# EasyEDA Pro project 3轴6.1--esp32 -(1031) I2S.eprj, board PCB
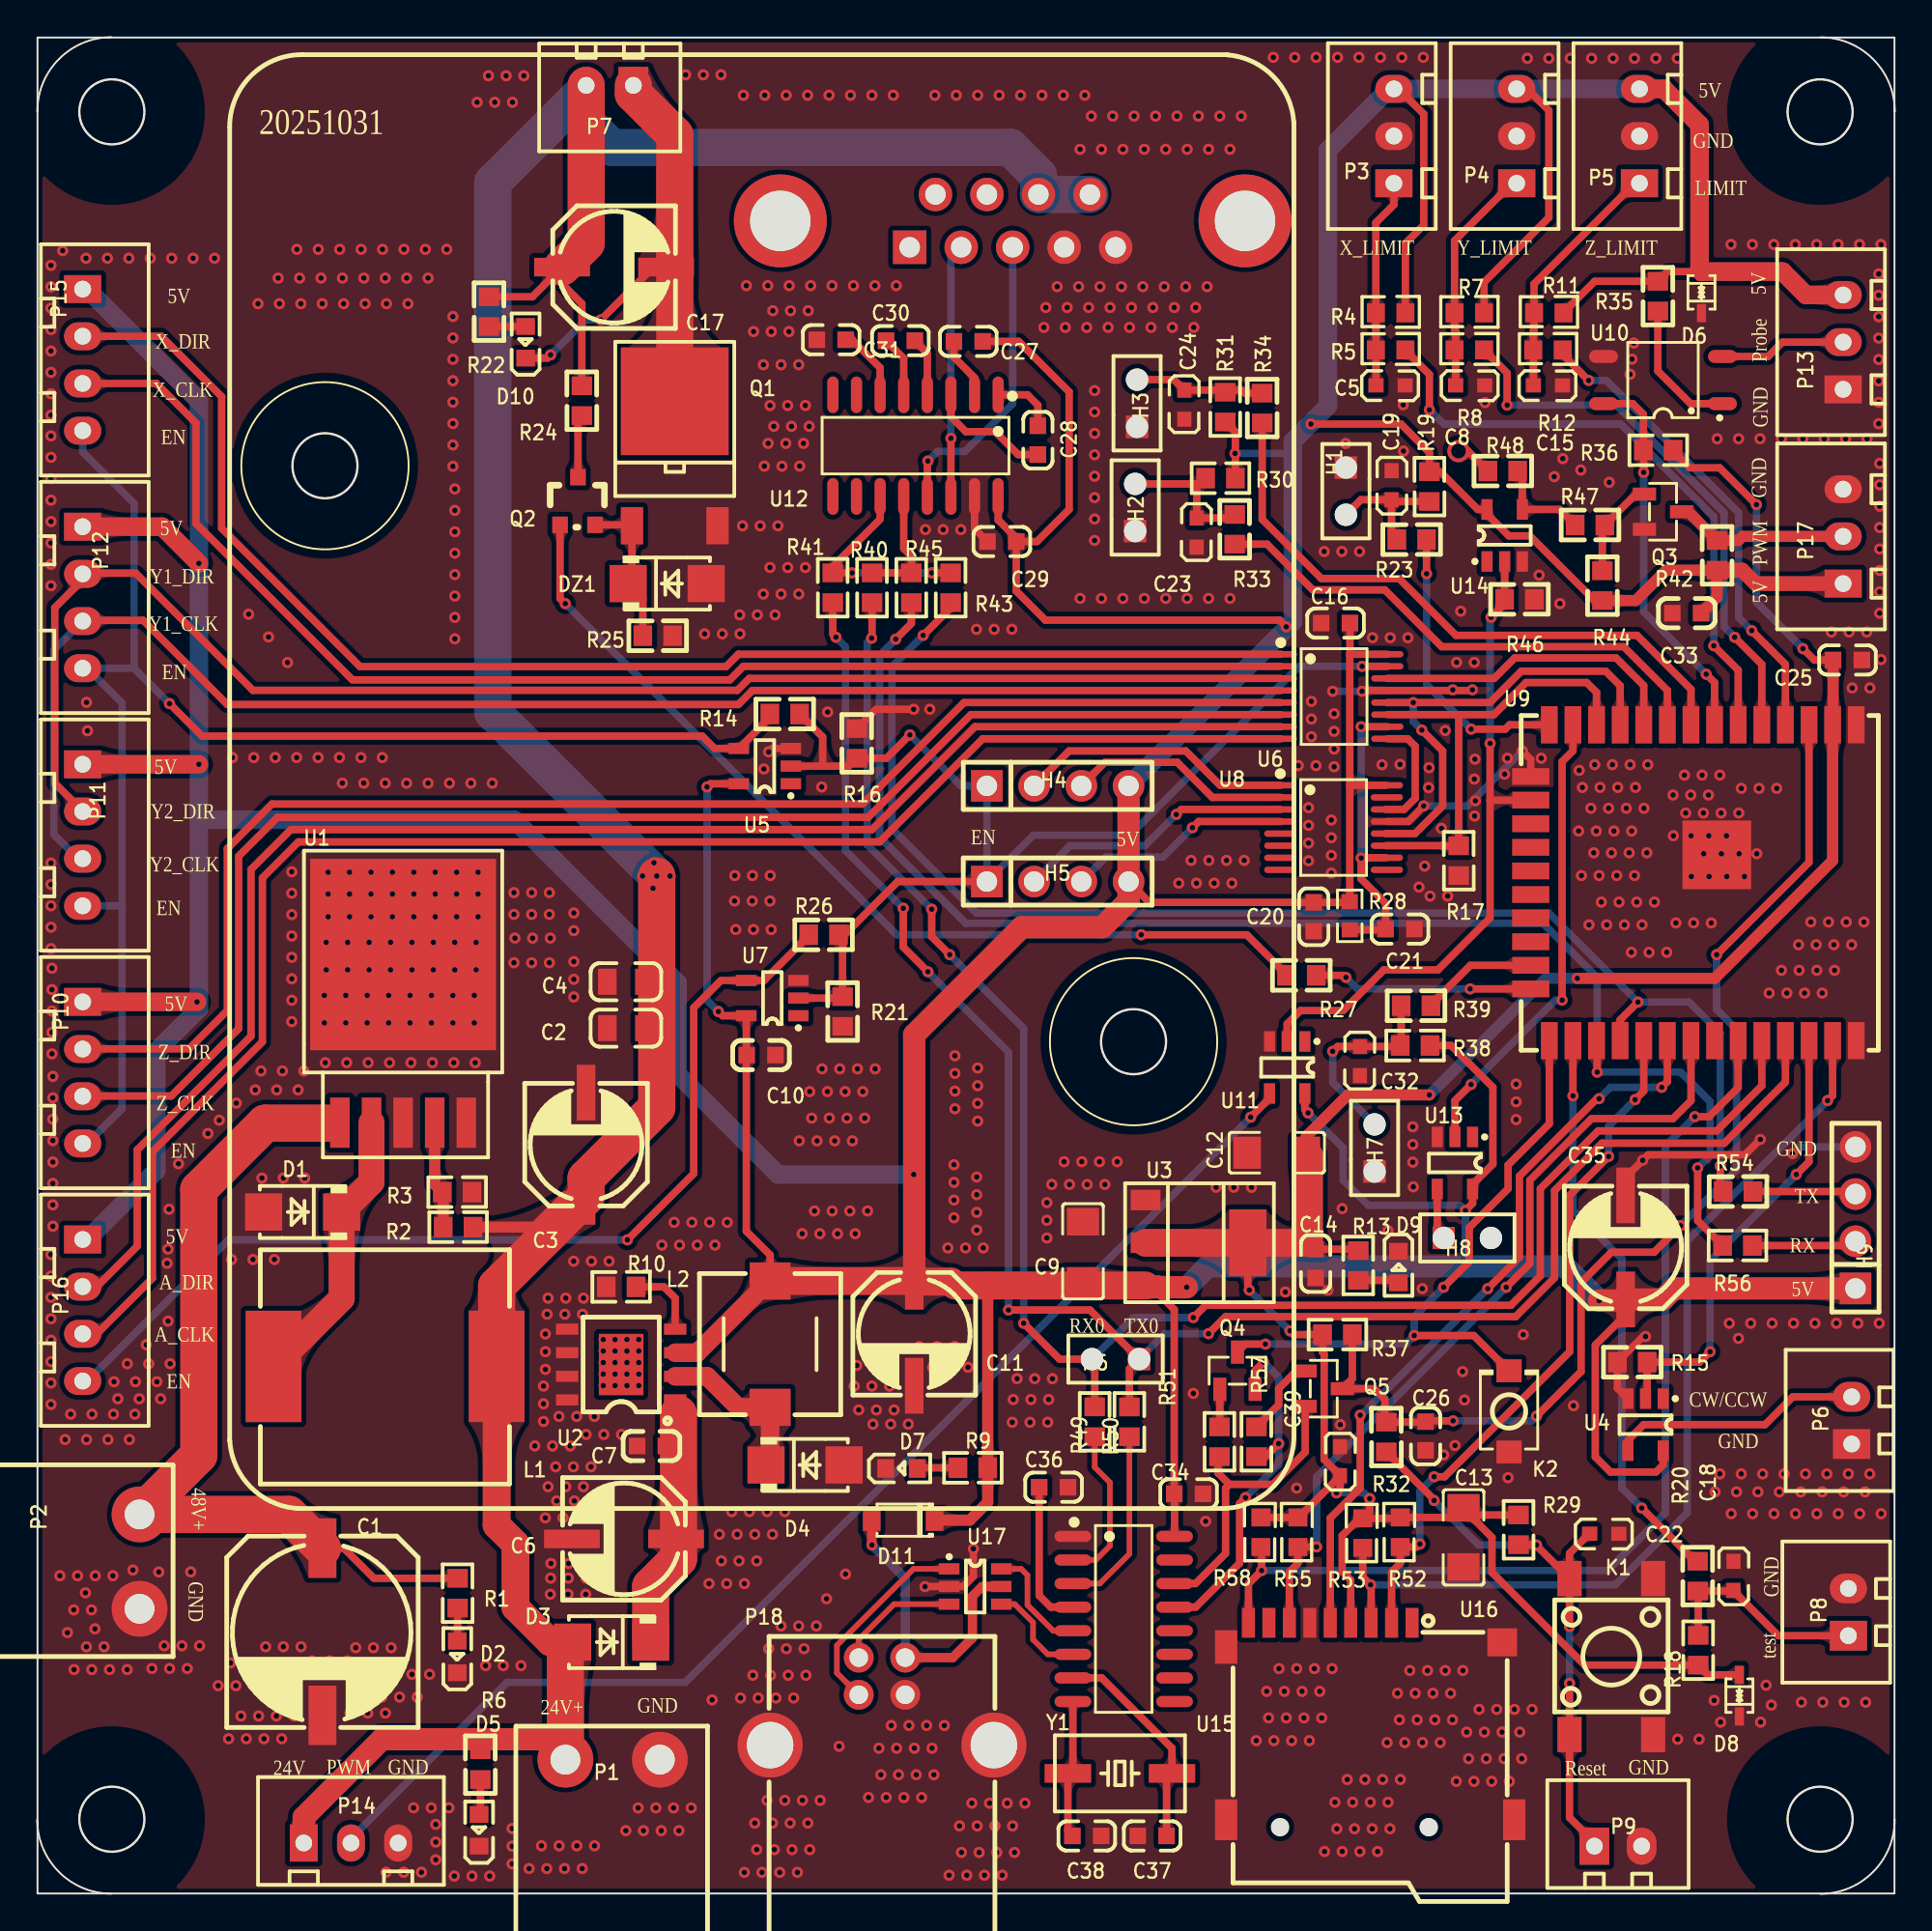
[diagram p1: board, top side]
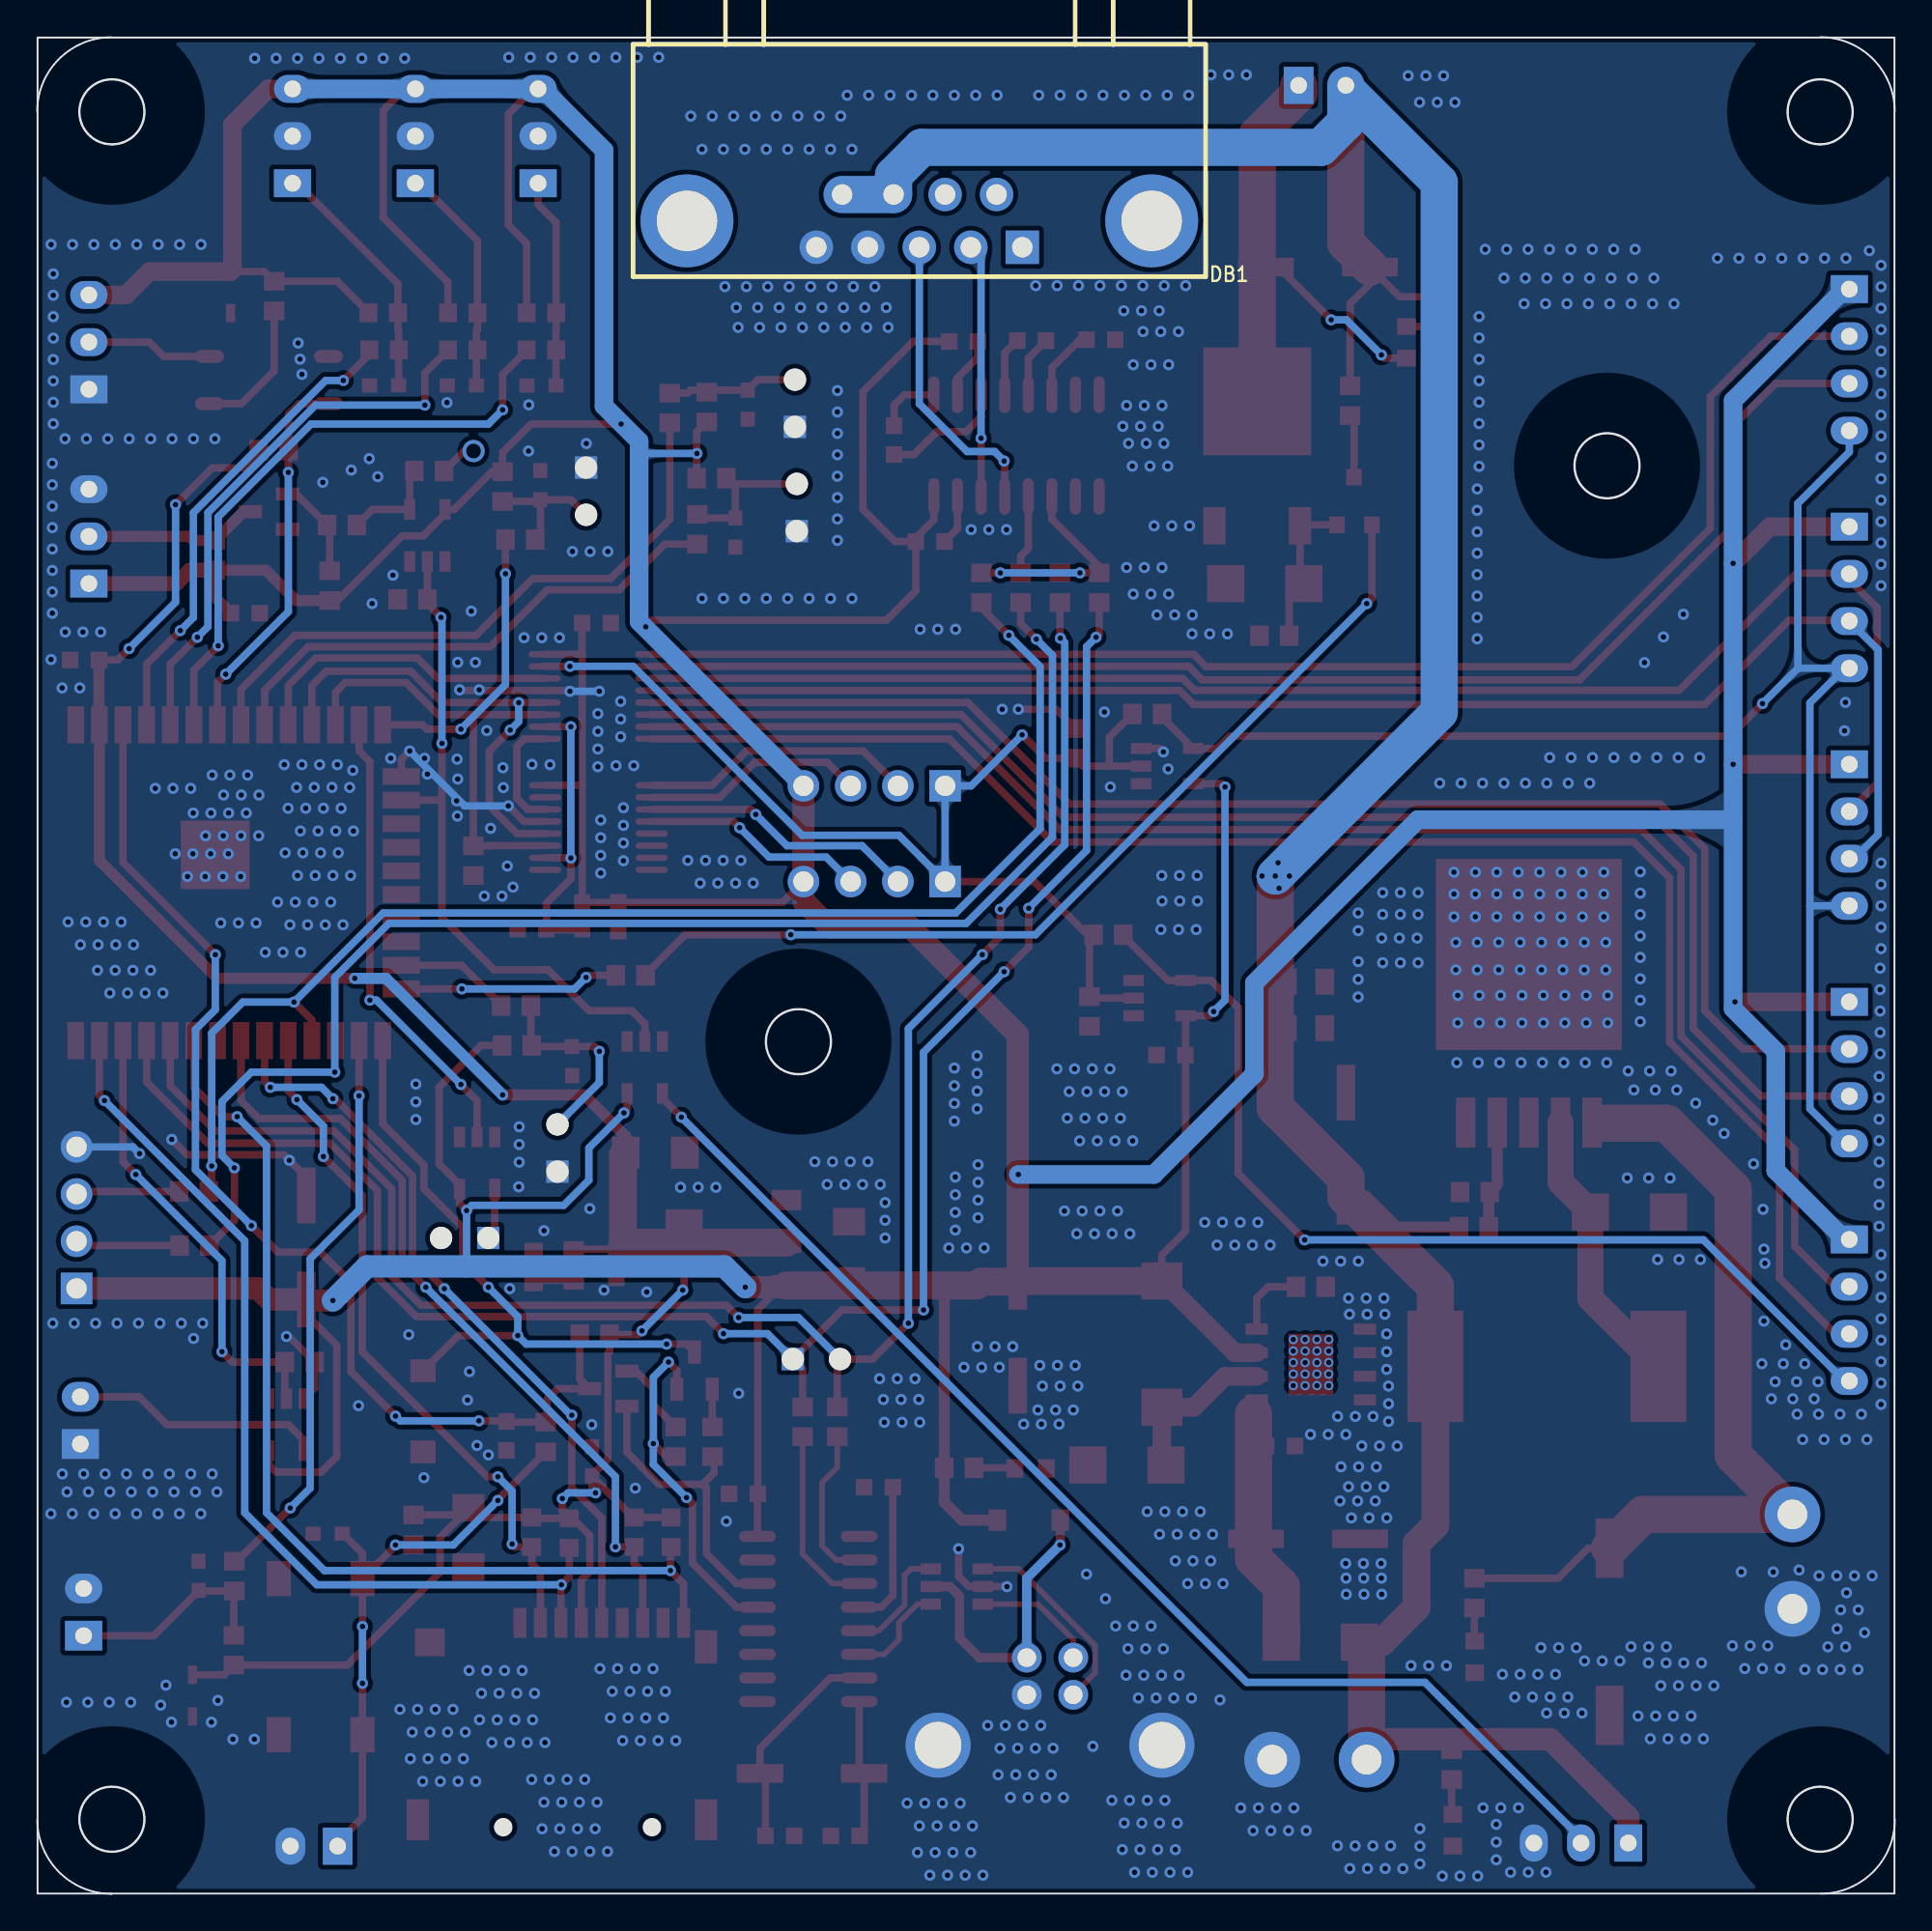
[diagram p2: board, bottom side, seen from below]

Outline 99.94 x 99.94 mm; copper layers: Top Layer, Bottom Layer. Coordinates in mm from the lower left corner of the outline.
Outline path: rectangle 0.02,99.92 99.92,0.02 ; circle c4.02,95.92 r1.75 ; circle c4.02,4.02 r1.75 ; circle c15.48,76.87 r1.75 ; circle c58.98,45.87 r1.75 ; circle c95.92,95.92 r1.75 ; circle c95.92,4.02 r1.75 ; 0.01,95.94 arc(1.18,98.77) 4.01,99.94 ; 4,0.01 arc(1.17,1.18) 0,4.01 ; 95.94,99.93 arc(98.77,98.76) 99.94,95.93 ; 99.93,4 arc(98.76,1.17) 95.93,0
Stack: Top Layer 0.035mm / Dielectric1 1.51mm FR4 er 4.5 / Bottom Layer 0.035mm

## Design rules (mm)
template: 用户自定义配置
spacing Default (default): track to track 0.152, other pairs 0 to 0.152
track width Default (default): min 0.254, default 0.254, max 25.4
differential pair differentialPair (default): width min 0.127, default 0.254, max 2.54; gap min 0.152, default 0.152
via Default (default): diameter min 0.25, default 0.61, max 100.025; hole min 0.2, default 0.305, max 59.995

## Placement (name value [footprint] x y rotation side)
C1  100uF/63V  [电解电容贴片10x10]  15.25 14.36 270 top
C2  104  [0805C]  31.67 46.6 0 top
C3  100uF/35V  [电解电容贴片6X6]  29.53 40.32 90 top
C4  105  [0805C]  31.67 49.09 180 top
C5  103  [11]  73.55 80.89 0 top
C6  100uF/35V  [电解电容贴片6X6]  31.57 19.11 180 top
C7  104  [0603C]  33.05 24.1 0 top
C8  103  [11]  77.83 80.89 0 top
C9  10uF  [C1206]  56.26 34.58 90 top
C10  104  [0603C]  38.94 45.15 180 top
C11  100uF/35V  [电解电容贴片6X6]  47.18 30.15 270 top
C12  4.7uF  [C1206]  66.69 39.89 0 top
C13  4.7uF  [C1206]  76.73 19.19 90 top
C14  104  [0603C]  68.78 33.92 90 top
C15  103  [11]  82.02 80.89 0 top
C16  104  [0603C]  69.85 68.4 180 top
C17  100uF/35V  [电解电容贴片6X6]  31.04 87.56 0 top
C18  103  [11]  91.55 17.86 90 top
C19  103  [11]  73.16 76.56 90 top
C20  104  [0603C]  68.68 52.59 270 top
C21  104  [0603C]  73.32 51.93 180 top
C22  103  [11]  85.05 19.08 0 top
C23  103  [11]  62.08 72.53 270 top
C24  103  [11]  61.42 79.41 270 top
C25  104  [0603C]  97.39 66.41 0 top
C26  104  [0603C]  74.69 24.64 90 top
C27  104  [0603C]  50.09 83.56 180 top
C28  104  [0603C]  53.83 78.24 90 top
C29  104  [0603C]  51.9 72.79 0 top
C30  104  [0603C]  46.44 83.6 0 top
C31  104  [0603C]  42.72 83.65 180 top
C32  103  [11]  70.87 44.08 270 top
C33  104  [0603C]  88.74 68.93 0 top
C34  104  [0603C]  61.94 21.53 0 top
C35  100uF/35V  [电解电容贴片6X6]  85.46 34.79 90 top
C36  104  [0603C]  54.68 21.89 0 top
C37  18pF  [0603C]  59.98 3.12 180 top
C38  18pF  [0603C]  56.46 3.12 0 top
C39  104  [11]  70.39 24.03 90 top
D1  SS56  [SMA]  14.28 36.7 180 top
D2  红光  [0603LED]  22.62 12.72 270 top
D3  SS56  [SMA]  30.91 13.55 180 top
D4  SS34  [SMA]  41.31 23.08 0 top
D5  绿光  [0603LED]  23.79 3.38 270 top
D6  PESD5V0L1BA-N  [SOD-323_L1.8-W1.3-LS2.5-BI]  89.53 86.2 90 top
D7  绿光  [0603LED]  46.46 22.88 180 top
D8  PESD3V3L1BA-N  [SOD-323_L1.8-W1.3-LS2.5-BI]  91.57 10.67 90 top
D9  绿光  [0603LED]  73.21 33.77 90 top
D10  绿光  [0603LED]  26.29 83.48 270 top
D11  1N4148  [SOD-123_L2.8-W1.8-LS3.7-RD]  46.59 20.11 180 top
DB1  XDDB-1809-0816  [DB9-TH_LD09P33E4GV00LF]  52.48 90.05 0 bottom
DZ1  --ѹ------SMAZ10V  [SMA]  33.89 70.53 0 top
H1  PZ254  [HDR-TH_2P-P2.54-V-M]  70.41 75.5 270 top
H2  PZ254V-11-02P  [HDR-TH_2P-P2.54-V-M]  59.07 74.62 90 top
H3  PZ254V-11-02P  [HDR-TH_2P-P2.54-V-M]  59.17 80.23 90 top
H4  PZ254  [HDR-TH_4P-P2.54-V-M]  54.9 59.64 0 top
H5  PZ254  [HDR-TH_4P-P2.54-V-M]  54.9 54.49 0 top
H6  PZ254V-11-02P  [HDR-TH_2P-P2.54-V-M]  58.01 28.78 180 top
H7  PZ254  [HDR-TH_2P-P2.54-V-M]  71.95 40.15 90 top
H8  PZ254  [HDR-TH_2P-P2.54-V-M]  76.94 35.3 0 top
H9  PZ254V-11-04P  [HDR-TH_4P-P2.54-V-M]  97.82 36.4 90 top
K1  SW_6X6_H=12.0MM  [KEY-SMD_4P-L6.0-W6.0-P4.50-LS9.0]  84.69 12.77 270 top
K2  TS-1088-AR02016  [SW-SMD_L3.9-W3.0-P4.45]  79.18 25.97 90 top
L1  47uH/5A  [IND-SMD_L13.45-W12.6]  18.72 28.39 0 top
L2  68uH  [IND-SMD_L7.0-W7.0_SMDRI74-330MT]  39.43 29.59 270 top
P1  WJ2EDGR-5.08-2P  [CONN-TH_WJ2EDGR-5.08-2P]  30.96 7.22 0 top
P2  WJ2EDGR-5.08-2P  [CONN-TH_WJ2EDGR-5.08-2P]  5.51 17.88 270 top
P3  3P  [HDR1X3_CON]  72.99 94.61 90 top
P4  3P  [HDR1X3_CON]  79.59 94.61 90 top
P5  3P  [HDR1X3_CON]  86.2 94.61 90 top
P6  2P  [HDR1X2_CON]  97.62 25.48 90 top
P7  2P  [HDR1X2_CON]  30.8 97.34 180 top
P8  2P  [HDR1X2_CON]  97.44 15.17 90 top
P9  2P  [HDR1X2_CON]  85.04 2.57 0 top
P10  4P  [HDR1X4_CON]  2.45 48.01 270 top
P11  4P  [HDR1X4_CON]  2.45 60.8 270 top
P12  4P  [HDR1X4_CON]  2.45 73.59 270 top
P13  3P  [HDR1X3_CON]  97.16 83.52 90 top
P14  3P  [HDR1X3_CON]  16.88 2.74 0 top
P15  4P  [HDR1X4_CON]  2.45 86.38 270 top
P16  4P  [HDR1X4_CON]  2.45 35.22 270 top
P17  3P  [HDR1X3_CON]  97.16 73.07 90 top
P18  USB-B10-BRW  [USB-B-TH_USB-B10-BRW]  45.45 10.36 0 top
Q1  F50N06 (FR9024N)  [TO-252]  34.3 76.24 0 top
Q2  SS8050  [SOT-23]  28.13 73.69 0 top
Q3  SS8050  [SOT-23-3_L2.9-W1.3-P1.90-LS2.4-BR]  87.47 74.39 180 top
Q4  SS8050  [SOT-23-3_L2.9-W1.3-P1.90-LS2.4-BR]  64.57 28.16 270 top
Q5  SS8050  [SOT-23-3_L2.9-W1.3-P1.90-LS2.4-BR]  69.21 27.19 180 top
R1  -  [0603R]  22.62 16.19 90 top
R2  44.2K  [0603R]  22.64 35.89 0 top
R3  2.37K  [0603R]  22.59 37.77 180 top
R4  22K  [10]  71.92 84.98 0 top
R5  100  [10]  71.92 82.98 0 top
R6  47K  [0603R]  23.84 6.95 90 top
R7  22K  [10]  76.15 84.98 0 top
R8  100  [10]  76.15 82.98 0 top
R9  10K  [0603R]  50.34 22.93 0 top
R10  10K  [0603R]  31.42 32.67 180 top
R11  22K  [10]  80.43 84.98 0 top
R12  100  [10]  80.38 82.98 0 top
R13  10K  [0603R]  71.07 33.82 90 top
R14  0Ω  [0603R]  40.22 63.51 180 top
R15  10K  [0603R]  85.81 28.62 180 top
R16  10K  [0603R]  44.09 61.92 90 top
R17  10K  [0603R]  76.47 55.61 270 top
R18  10K  [0603R]  89.36 13.11 90 top
R19  10K  [0603R]  74.9 75.75 270 top
R20  100  [0603R]  89.33 17.1 270 top
R21  10K  [0603R]  43.33 47.49 270 top
R22  100K  [0603R]  24.3 85.16 270 top
R23  100  [0603R]  73.94 72.9 180 top
R24  50K  [0603R]  29.3 80.37 90 top
R25  10K  [0603R]  33.38 67.72 180 top
R26  0Ω  [0603R]  42.31 51.62 180 top
R27  2K  [0603R]  68.01 49.44 0 top
R28  10kΩ  [R0603]  70.61 52.64 90 top
R29  10K  [0603R]  79.69 19.59 270 top
R30  10K  [0603R]  63.66 76.2 180 top
R31  10K  [0603R]  63.91 80.03 90 top
R32  100  [0603R]  72.58 24.59 270 top
R33  100  [0603R]  64.42 73.45 90 top
R34  100  [0603R]  65.9 79.98 90 top
R35  1K  [0603R]  87.19 86 270 top
R36  10K  [0603R]  87.21 77.71 180 top
R37  10K  [0603R]  69.95 30.1 0 top
R38  10K  [0603R]  74.13 45.66 180 top
R39  100  [0603R]  74.18 47.81 180 top
R40  510Ω  [0603R]  44.91 70.3 90 top
R41  510Ω  [0603R]  42.8 70.3 90 top
R42  10K  [0603R]  90.37 72.05 270 top
R43  510Ω  [0603R]  49.14 70.3 90 top
R44  10K  [0603R]  84.2 70.41 270 top
R45  510Ω  [0603R]  47.03 70.3 90 top
R46  10K  [0603R]  79.74 69.68 0 top
R47  1K  [0603R]  83.54 73.68 0 top
R48  0Ω  [0603R]  78.85 76.58 0 top
R49  510Ω  [0603R]  56.89 25.41 90 top
R50  510Ω  [0603R]  58.76 25.41 90 top
R51  10K  [0603R]  63.6 24.33 90 top
R52  10K  [10]  73.45 18.57 90 top
R53  10K  [10]  71.43 18.52 90 top
R54  510Ω  [0603R]  91.5 37.8 0 top
R55  10K  [10]  67.94 18.57 90 top
R56  510Ω  [0603R]  91.47 34.89 0 top
R57  10K  [0603R]  65.59 24.33 90 top
R58  10K  [10]  65.95 18.57 90 top
U1  LM2576HVS-ADJ  [TO-263]  19.69 46.03 0 top
U2  XL1509-5.0E1//SXL1509-5.0E1  [ESOP-8_L4.9-W3.9-P1.27-LS6.0-BL-EP]  31.42 28.49 90 top
U3  1117-3.3  [SOT-223]  62.33 35.04 270 top
U4  74LVC1G17  [SOT-23-5]  86.53 25.25 270 top
U5  74LVC1G04  [SOT-23-5]  39.15 60.7 180 top
U6  74AHCT595T16-13  [TSSOP-16_L5.0-W4.4-P0.65-LS6.4-BL]  69.77 64.45 270 top
U7  74LVC1G04  [SOT-23-5]  39.55 48.21 180 top
U8  74AHCT595T16-13  [TSSOP-16_L5.0-W4.4-P0.65-LS6.4-BL]  69.74 57.39 270 top
U9  ESP32-WROOM-32  [WIFI-SMD_ESP32-WROOM-32UE-A]  89.1 54.42 270 top
U10  LTV-357T-C  [SOP-4_L4.4-W3.9-P2.54-LS7.0-TL]  87.47 81.48 180 top
U11  74LVC1G17  [SOT-23-5]  67.25 44.48 270 top
U12  SP3232EEN-L/TR  [SOIC-16_L9.9-W3.9-P1.27-LS6.0-BL]  47.25 77.95 180 top
U13  74LVC1G17  [SOT-23-5]  76.27 39.34 270 top
U14  74LVC1G04  [SOT-23-5]  78.95 73.12 90 top
U15  CH340G  [SOIC-16_L9.9-W3.9-P1.27-LS6.0-BL]  58.45 14.8 270 top
U16  自弹TF卡座TFAA  [SIM-SMD_C9900015645]  71.71 9.29 0 top
U17  USBLC2-2SC6  [SOT-23-6]  50.47 16.54 0 top
Y1  12M  [晶振贴片49SSMD]  58.25 6.48 0 top

## Footprints (pads in the part's own frame, mm; a bottom-side part is the same pattern mirrored in y, then rotated)
10
  rect 0.965x1.016 smd: 1(0.101,0.117) 2(1.688,0.117)
11
  rect 0.813x0.762 smd: 1(0.043,0.296) 2(-1.524,0.301)
0603C
  rect 0.889x0.889 smd: 1(-0.774,0) 2(0.774,0)
0603LED
  rect 0.9x1 smd: 1(-0.884,-0.017) 2(0.816,-0.017)
0603R
  rect 1x1.1 smd: 1(-0.8,0) 2(0.8,0)
0805C
  rect 1x1.4 smd: 1(-1,0) 2(1,0)
C1206
  rect 1.485x1.728 smd: 1(-1.593,0) 2(1.593,0)
CONN-TH_WJ2EDGR-5.08-2P
  round 3 hole 1.6: 1(-2.54,0) 2(2.54,0)
DB9-TH_LD09P33E4GV00LF
  rect 1.8x1.8 hole 1.1: 1(-5.54,1.42)
  round 1.8 hole 1.1: 2(-2.77,1.42) 3(0,1.42) 4(2.77,1.42) 5(5.54,1.42) 6(-4.155,-1.42) 7(-1.385,-1.42) 8(1.385,-1.42) 9(4.155,-1.42)
  round 5 hole 3.25: 10(12.5,0) 11(-12.5,0)
ESOP-8_L4.9-W3.9-P1.27-LS6.0-BL-EP
  rect 0.6x1.2 smd: 1(-1.905,-2.909) 2(-0.635,-2.909) 3(0.635,-2.909) 4(1.905,-2.909) 5(1.905,2.909) 6(0.635,2.909) 7(-0.635,2.909) 8(-1.905,2.909)
  rect 3.3x2.4 smd: 9(0,0)
HDR1X2_CON
  rect 1.6x2 hole 0.9: 1(-1.27,0)
  oval 1.6x2 hole 0.9: 2(1.27,0)
HDR1X3_CON
  rect 1.5x2 hole 0.9: 1(-2.54,0)
  oval 1.5x2 hole 0.9: 2(0,0) 3(2.54,0)
HDR1X4_CON
  rect 1.5x2 hole 0.9: 1(0,0)
  oval 1.5x2 hole 0.9: 2(2.54,0) 3(5.08,0) 4(7.62,0)
HDR-TH_2P-P2.54-V-M
  rect 1.2x1.2 hole 1.2x0.8: 1(-1.27,0)
  round 1.2 hole 1.2x0.8: 2(1.27,0)
HDR-TH_4P-P2.54-V-M
  rect 1.7x1.7 hole 1.1: 1(-3.81,0)
  round 1.7 hole 1.1: 2(-1.27,0) 3(1.27,0) 4(3.81,0)
IND-SMD_L7.0-W7.0_SMDRI74-330MT
  rect 2x2.2 smd: 1(-3.4,0) 2(3.4,0)
IND-SMD_L13.45-W12.6
  rect 3x6 smd: 1(-6,0) 2(6,0)
KEY-SMD_4P-L6.0-W6.0-P4.50-LS9.0
  rect 1.9x1.3 smd: 1(-4.2,2.25) 2(4.2,2.25) 3(-4.2,-2.25) 4(4.2,-2.25)
R0603
  rect 0.806x0.864 smd: 1(-0.753,0) 2(0.753,0)
SIM-SMD_C9900015645
  rect 0.7x1.6 smd: 1(2.25,5.3) 2(1.15,5.3) 3(0.05,5.3) 4(-1.05,5.3) 5(-2.15,5.3) 6(-3.25,5.3) 7(-4.35,5.3) 8(-5.45,5.3) 9(-6.55,5.3)
  rect 1.2x1.8 smd: 10(-7.75,4)
  rect 1.6x1.5 smd: 11(7.1,4.25)
  rect 1.2x2.2 smd: 12(-7.75,-5.3) 13(7.75,-5.3)
SMA
  rect 2x2 smd: 1(2.1,0) 2(-2.1,0)
SOD-123_L2.8-W1.8-LS3.7-RD
  rect 0.95x1.15 smd: 1(-1.692,0) 2(1.692,0)
SOD-323_L1.8-W1.3-LS2.5-BI
  rect 0.986x0.49 smd: 1(-1.117,0) 2(1.117,0)
SOIC-16_L9.9-W3.9-P1.27-LS6.0-BL
  oval 0.602x1.971 smd: 1(-4.445,-2.736) 2(-3.175,-2.736) 3(-1.905,-2.736) 4(-0.635,-2.736) 5(0.635,-2.736) 6(1.905,-2.736) 7(3.175,-2.736) 8(4.445,-2.736) 9(4.445,2.736) 10(3.175,2.736) 11(1.905,2.736) 12(0.635,2.736) 13(-0.635,2.736) 14(-1.905,2.736) 15(-3.175,2.736) 16(-4.445,2.736)
SOP-4_L4.4-W3.9-P2.54-LS7.0-TL
  oval 1.55x0.7 smd: 1(-3.2,1.27) 2(-3.2,-1.27) 3(3.2,-1.27) 4(3.2,1.27)
SOT-23
  rect 0.838x0.889 smd: 1(0,0) 2(1.879,0) 3(0.965,2.566)
SOT-23-3_L2.9-W1.3-P1.90-LS2.4-BR
  rect 1.25x0.7 smd: 1(1,-0.95) 2(1,0.95) 3(-1,0)
SOT-23-5
  rect 1.1x0.6 smd: 1(-1.4,0.95) 2(-1.4,0) 3(-1.4,-0.95) 4(1.4,-0.95) 5(1.4,0.95)
SOT-23-6
  rect 1.1x0.6 smd: 1(-1.4,0.95) 2(-1.4,0) 3(-1.4,-0.95) 4(1.4,-0.95) 5(1.4,0) 6(1.4,0.95)
SOT-223
  rect 1.1x1.6 smd: 1(-2.3,-2.7) 2(0,-2.7) 3(2.3,-2.7)
  rect 3.6x2 smd: 4(0,2.8)
SW-SMD_L3.9-W3.0-P4.45
  rect 1.23x1.36 smd: 1(-2.185,0) 2(2.185,0)
TO-252
  rect 1.2x2 smd: 1(-2.3,-2.6) 3(2.3,-2.6)
  rect 5.8x5.8 smd: 2(0,4.1)
TO-263
  rect 1.05x2.7 smd: 1(-3.4,-4.526) 2(-1.7,-4.526) 3(0,-4.526) 4(1.7,-4.526) 5(3.4,-4.526)
  rect 10x10.3 smd: 3(0,4.526)
TSSOP-16_L5.0-W4.4-P0.65-LS6.4-BL
  oval 0.343x1.732 smd: 1(-2.275,-2.866) 2(-1.625,-2.866) 3(-0.975,-2.866) 4(-0.325,-2.866) 5(0.325,-2.866) 6(0.975,-2.866) 7(1.625,-2.866) 8(2.275,-2.866) 9(2.275,2.866) 10(1.625,2.866) 11(0.975,2.866) 12(0.325,2.866) 13(-0.325,2.866) 14(-0.975,2.866) 15(-1.625,2.866) 16(-2.275,2.866)
USB-B-TH_USB-B10-BRW
  round 1.6 hole 1: 1(1.25,2.355) 2(-1.25,2.355) 3(-1.25,0.355) 4(1.25,0.355)
  round 3.5 hole 2.5: 5(-6.02,-2.355) 6(6.02,-2.355)
WIFI-SMD_ESP32-WROOM-32UE-A
  rect 2x0.9 smd: 1(-8.5,8.755) 2(-8.5,7.485) 3(-8.5,6.215) 4(-8.5,4.945) 5(-8.5,3.675) 6(-8.5,2.405) 7(-8.5,1.135) 8(-8.5,-0.135) 9(-8.5,-1.405) 10(-8.5,-2.675) 11(-8.5,-3.945) 12(-8.5,-5.215) 13(-8.5,-6.485) 14(-8.5,-7.755) 25(8.5,-7.755) 26(8.5,-6.485) 27(8.5,-5.215) 28(8.5,-3.945) 29(8.5,-2.675) 30(8.5,-1.405) 31(8.5,-0.135) 32(8.5,1.135) 33(8.5,2.405) 34(8.5,3.675) 35(8.5,4.945) 36(8.5,6.215) 37(8.5,7.485) 38(8.5,8.755)
  rect 0.9x2 smd: 15(-5.715,-8.755) 16(-4.445,-8.755) 17(-3.175,-8.755) 18(-1.905,-8.755) 19(-0.635,-8.755) 20(0.635,-8.755) 21(1.905,-8.755) 22(3.175,-8.755) 23(4.445,-8.755) 24(5.715,-8.755)
  rect 3.7x3.7 smd: 39(-1.5,1.255)
晶振贴片49SSMD
  rect 2.5x1 smd: 1(-2.8,0) 2(2.8,0)
电解电容贴片6X6
  rect 3x1 smd: 1(-2.8,0) 2(2.8,0)
电解电容贴片10x10
  rect 3.2x1.5 smd: 1(-4.242,0.097) 2(4.758,0.097)

## Nets
As in the schematic, except:
24V: C2.2 C3.1 C4.1 C17.1 D3.1 DB1.8 DB1.9 L1.2 P1.1 P7.2 P14.1 R2.2 R6.2 R22.1 R24.2
48V_IN: C1.1 P2.1 R1.2 U1.1
GND: C1.2 C2.1 C3.2 C4.2 C5.1 C6.2 C7.1 C8.1 C9.2 C10.1 C11.2 C12.1 C13.1 C14.1 C15.1 C16.2 C18.1 C19.1 C20.2 C21.1 C22.1 C23.1 C24.1 C25.2 C26.1 C29.1 C31.2 C32.1 C33.1 C34.2 C35.2 C36.2 C37.2 C38.2 C39.1 D1.1 D2.2 D4.1 D5.2 D6.1 D7.2 D8.1 D9.2 DB1.4 DB1.5 DZ1.1 H1.1 H2.1 H3.1 H7.1 H9.4 K1.1 K1.2 K2.1 P1.2 P2.2 P3.2 P4.2 P5.2 P6.1 P8.2 P9.2 P13.1 P14.3 P17.3 P18.4 P18.5 P18.6 Q1.3 Q3.2 R3.1 R10.2 R15.2 R16.2 R17.2 R21.2 R25.1 R46.2 U1.3 U1.5 U2.5 U2.6 U2.7 U2.8 U3.1 U4.3 U5.3 U6.13 U7.3 U8.13 U9.1 U9.15 U9.38 U9.39 U10.3 U11.3 U12.15 U13.3 U14.3 U15.1 U16.6 U16.10 U16.11 U16.12 U16.13 U17.2
IO2: R27.2 U9.24
$9N121473: D10.1 R22.2
$9N121474: C17.2 D10.2 P7.1 Q1.2
$9N121477: DZ1.2 Q1.1 Q2.2 R25.2
$9N121478: Q2.3 R24.1
$9N121481: Q2.1 R27.1
$9N139059: D1.2 L1.1 U1.2
$9N139060: R2.1 R3.2 U1.4
$9N139064: D2.1 R1.1

Pads without a net: DB1 1 6 7 10 11; H8 2; U2 9; U4 1; U5 1; U7 1; U8 9 15; U9 17 18 19 20 21 22 32; U11 1; U12 9 10; U13 1; U14 1; U15 9 10 11 12 15; U16 1 8

## Via types
v1: diameter 0.5, hole 0.3, Top Layer to Bottom Layer, 20 vias
v2: diameter 0.6, hole 0.3, Top Layer to Bottom Layer, 1147 vias
v3: diameter 1.2, hole 0.8, Top Layer to Bottom Layer, 1 via

## Routing (per net, layer and track width the routed paths; a pad name or vN(x,y) marks a point on that pad's centre or on a via; arc(x,y) is an arc through that point)
3V3: length 138
  Top Layer w0.4: R13.2 71,34.7 68.78,34.7 ; R53.2 71.13,20.21 70.21,19.29 70.21,17.35 70.66,16.89 U16.4 ; R53.2 71.68,20.58 v2(71.68,21.28) ; R53.2 73.28,20.21 R52.2 76.21,20.26 C13.2 ; v2(92.49,74.78) 90.51,76.76 88.91,76.76 88.01,77.66 R36.1 ; R58.2 R55.2 67.87,20.26 70.09,22.48 ; v2(69.9,21.58) 70.09,21.77 70.09,22.48 ; 70.09,22.48 C39.2 70.09,22.53 69.24,23.38 69.24,29.06 69.15,29.15 R37.1 67.6,30.1 v2(67.4,30.3) ; 96.61,66.41 95.6,66.41 v2(94.99,67.02) ; D8.2 89.89,11.79 R18.1 83.25,12.31 78.26,17.3 78.26,19.19 76.73,20.72 C13.2 ; C13.2 77.12,20.39 79.69,20.39 ; v2(65.21,32.5) 65.13,32.57 U3.4
  Top Layer w0.6: C12.2 68.28,40.77 70.51,43 v2(74.9,43) ; 96.61,66.41 96.61,62.95 U9.2 96.59,55.62 90.25,49.28 v2(82.85,49.28)
  Top Layer w1.5: U3.2 U3.4 68.1,35.04 ; 68.1,35.03 68.42,35.35 68.42,39.75 C12.2
  Bottom Layer w0.4: v2(71.68,21.28) 71.38,21.58 v2(69.9,21.58) ; v2(67.4,30.3) v2(65.21,32.5) ; v2(94.99,67.02) 92.49,69.52 v2(92.49,74.78)
  Bottom Layer w0.6: v2(82.85,49.28) 81.17,49.28 v2(74.9,43)
5V_VCC: length 551.1
  Top Layer w0.4: 72.56,59.67 70.65,59.67 70.61,59.64 ; v2(67.2,68.2) 66.84,68.55 54.24,68.55 52.67,70.13 C29.2 ; 72.63,66.72 70.63,66.72 70.62,66.73 ; U15.16 61.19,21.51 C34.1 61.17,31.45 59.97,32.65 ; 70.62,66.73 70.61,66.72 70.61,59.64 ; 70.62,66.73 C16.1 ; R44.2 83.78,69.61 80.3,73.09 79.17,73.09 78,74.27 U14.5 77.5,74.52 75.47,76.55 R19.1 74.9,77.58 73.37,79.11 v2(68.52,79.11) ; C29.2 52.67,72.98 51.7,73.96 U12.16 ; C29.2 53.78,72.79 55.52,74.52 55.52,80.85 52.8,83.56 C27.1 ; v2(68.37,42.03) 68.2,42.21 U11.5 ; R4.2 73.61,88.84 74.59,89.82 74.59,95.8 73.24,97.15 P3.3 ; v2(36.03,59.58) 36.21,59.75 U5.5 ; R11.2 82.12,85.12 83.79,86.8 R35.1 87.71,87.32 D6.2 ; v2(36.65,47.49) 36.87,47.26 38.15,47.26 38.15,35.67 39.43,34.39 L2.1 ; U4.5 87.48,23.09 87.09,22.7 84.64,22.7 83.82,23.52 83.82,29.54 85.46,31.17 C35.1 ; R30.1 64.46,78.68 R31.1 ; 77.84,85.1 77.84,86.74 81.32,90.23 81.32,95.99 80.16,97.15 P4.3 ; 70.61,59.64 70.61,53.4 70.58,53.37 59.83,53.37 H5.4 ; v2(76.84,36.78) 77.22,37.17 U13.5 77.22,38.19 78.31,39.28 78.31,43.41 76.06,45.66 R38.1
  Top Layer w0.6: D11.1 50.17,20.11 51.14,21.08 R9.2 51.14,32.68 51.2,32.74 ; R44.2 86,69.61 87.64,71.25 R42.2 90.37,69.79 C33.2
  Top Layer w0.8: P17.1 92.44,70.53 91.72,71.25 R42.2
  Top Layer w1: P10.1 v2(8.6,48.01) ; P5.3 87.51,97.15 89.43,95.23 89.43,87.42 D6.2 93.9,87.32 95.16,86.06 P13.3 ; 39.37,32.99 35.51,29.13 U2.3 ; v2(8.7,71.61) 6.73,73.59 P12.1 ; P11.1 v2(8.7,60.8)
  Top Layer w1.2: H4.4 H5.4 58.71,53.44 57.3,52.03 52.97,52.03 47.18,46.25 C11.1 ; U3.3 59.72,32.65 v2(61.84,32.65) ; v2(84.03,31.94) 85.4,31.94 C35.1 87.46,31.99 88.05,32.59 H9.1
  Top Layer w1.5: U3.3 49.39,32.74 49.18,32.95 C11.1 47.14,32.99 L2.1
  Bottom Layer w0.4: 67.55,77.53 v2(64.44,77.53) ; v2(36.65,47.49) 36.03,48.1 v2(36.03,59.58) ; v2(68.37,42.03) 70.26,40.15 70.26,38.41 71.61,37.06 76.56,37.06 v2(76.84,36.78) 76.84,33.83 76.89,33.77
  Bottom Layer w1: 8.7,57.82 8.7,47.64 6.4,45.35 6.4,38.93 2.7,35.22 P16.1 ; 8.7,57.82 v2(8.7,60.8) v2(8.7,71.61) 8.7,80.38 2.7,86.38 P15.1 ; 8.7,57.82 25.66,57.82 34.45,49.02 34.45,44.13 39.86,38.72 v2(47.15,38.72) ; H4.4 67.55,68.48 67.55,78.19 69.44,80.08 69.44,93.85 72.74,97.15 P3.3 P4.3 P5.3
  Bottom Layer w1.2: v2(61.84,32.65) 62.96,33.77 82.19,33.77 v2(84.03,31.94)
24V: length 179.2
  Top Layer w0.4: R22.1 26.64,85.96 C17.1 28.24,86.66 29.3,85.59 R24.2
  Top Layer w0.6: C3.1 28.43,37.52 26.79,35.89 R2.2
  Top Layer w1.2: P14.1 14.34,4.12 18.54,8.32 27.32,8.32 P1.1
  Top Layer w1.5: D3.1 27.6,13.55 25.73,15.42 25.73,18.84 24.72,19.85 L1.2
  Top Layer w2: L1.2 24.72,32.71 C3.1 29.53,38.52 33.33,42.33 v2(33.33,54.78) ; D3.1 28.42,13.16 P1.1 ; P7.2 29.53,88.86 C17.1
  Bottom Layer w2: 29.53,97.14 P7.2 ; 29.53,97.14 24.51,92.12 24.51,63.61 v2(33.33,54.78) ; 29.53,97.14 29.53,95.35 30.88,94 52.36,94 53.86,92.49 DB1.8 56.63,91.47
  vias: v2(32.57,54.78) v2(33.13,54.12) v2(33.18,55.5) v2(34.05,54.78)
48V_IN: length 45.8
  Top Layer w0.4: R1.2 18.12,16.98 16.5,18.61 C1.1
  Top Layer w2: C1.1 13.53,20.42 P2.1 8.69,23.61 8.69,37.91 12.27,41.48 15.63,41.48
GND: length 46.6
  Top Layer w0.4: v2(71.28,64.73) 71.32,64.77 77.18,64.77 v2(77.21,64.81) ; R16.2 45.13,63.76 v2(47.15,63.76) ; v2(92.7,40.61) 91.87,39.78 86.67,39.78 v2(86.37,39.48) 85.46,38.57 C35.2 ; U9.15 80.35,61.06 v2(79.9,61.52) ; U5.3 39.53,61.65 v2(39.35,61.47) ; C29.1 50.43,73.48 U12.15 ; U4.3 85.01,27.22 R15.2 86.39,30 v2(86.53,30) ; U8.13 73.75,57.72 v2(74.59,58.56) ; v2(47.77,16.53) 47.77,16.54 U17.2 49.81,16.54 50.37,17.09 v2(50.37,18.57)
  Bottom Layer w0.4: v2(79.9,61.52) 76.94,58.56 v2(74.59,58.56) ; H9.4 94.8,40.21 v2(94.43,39.84) ; v2(71.28,64.73) v2(69.7,64.73)
  vias: v2(0.74,87.65) v2(0.74,86.5) v2(0.74,85.35) v2(0.74,84.2) v2(0.74,83.04) v2(0.74,81.89) v2(0.74,80.74) v2(0.74,79.59) v2(0.74,78.47) v2(0.74,77.32) v2(0.74,76.17) v2(0.74,75.02) v2(0.74,73.86) v2(0.74,72.71) v2(0.74,71.56) v2(0.74,70.41) v2(0.74,55.48) v2(0.74,54.33) v2(0.74,53.18) v2(0.74,52.03) v2(0.74,50.87) v2(0.79,49.82) v2(0.79,48.67) v2(0.79,47.52) v2(0.79,46.37) v2(0.79,45.21) v2(0.74,34.41) v2(0.74,33.26) v2(0.74,32.1) v2(0.74,30.95) v2(0.74,29.8) v2(0.74,28.65) v2(0.74,27.5) v2(0.74,26.34) v2(0.84,44) v2(0.84,42.85) v2(0.84,41.69) v2(0.84,40.54) v2(0.84,39.39) v2(0.84,38.24) v2(0.84,37.08) v2(0.84,35.93) v2(1.22,17.12) v2(1.37,88.45) v2(1.5,24.45) v2(1.63,14.06) v2(1.8,25.82) v2(1.97,15.28) v2(1.98,12.07) v2(2.17,17.12) v2(2.63,88.04) v2(2.6,16.2) v2(2.65,64.13) v2(2.71,62.6) v2(2.65,24.45) v2(2.65,13.3) v2(2.92,15.28) v2(2.94,12.07) v2(2.95,25.82) v2(3.12,17.12) v2(3.11,14.26) v2(3.6,13.3) v2(3.78,88.04) v2(3.81,24.45) v2(3.89,12.07) v2(4.13,27.56) v2(4.1,25.82) v2(4.08,17.12) v2(4.34,26.65) v2(4.93,88.04) v2(4.85,28.53) v2(4.84,12.07) v2(4.96,24.45) v2(5.15,17.43) v2(5.29,27.56) v2(5.26,25.82) v2(5.49,26.65) v2(5.87,29.55) v2(6,28.53) v2(6.08,88.04) v2(6.17,12.13) v2(6.44,27.56) v2(6.54,17.32) v2(6.64,26.65) v2(6.83,13.35) v2(6.99,33.94) v2(7.09,36.85) v2(7.04,34.7) v2(7.04,30.83) v2(7.12,12.13) v2(7.24,88.04) v2(7.15,28.53) v2(7.6,39.29) v2(7.79,13.35) v2(8.07,12.13) v2(8.26,17.33) v2(8.39,88.04) v2(8.74,13.35) v2(9.18,40.93) v2(9.54,88.04) v2(9.74,11.2) v2(9.79,41.64) v2(10.3,8.35) v2(10.4,12.43) v2(10.5,61.16) v2(10.46,34.14) v2(10.71,42.56) v2(10.69,11.2) v2(10.96,9.57) v2(11.25,8.35) v2(11.38,68.88) v2(11.35,12.43) v2(11.61,34.14) v2(11.65,61.16) v2(11.73,43.27) v2(11.64,11.2) v2(11.88,85.59) v2(11.91,9.57) v2(12.04,44.29) v2(12.09,38.53) v2(12.2,8.35) v2(12.29,13.3) v2(12.3,12.43) v2(12.45,67.65) v2(12.59,11.2) v2(12.81,61.16) v2(12.76,34.14) v2(12.88,43.27) v2(12.86,9.57) v2(12.96,86.97) v2(13.03,85.59) v2(13.19,44.29) v2(13.15,8.35) v2(13.24,38.53) v2(13.24,13.3) v2(13.26,12.43) v2(13.47,66.27) v2(13.7,55.01) v2(13.7,53.86) v2(13.7,52.71) v2(13.7,51.56) v2(13.7,50.4) v2(13.7,49.25) v2(13.7,48.1) v2(13.7,46.95) v2(13.82,9.57) v2(13.97,88.52) v2(13.96,61.16) v2(14.04,43.27) v2(14.12,86.97) v2(14.18,85.59) v2(14.19,13.3) v2(14.34,44.29) v2(14.39,38.53) v2(14.79,12.54) v2(15.12,88.52) v2(15.11,61.16) v2(15.27,86.97) v2(15.34,85.59) v2(15.45,48.36) v2(15.45,46.88) v2(15.5,44.74) v2(15.55,51.21) v2(15.55,49.74) v2(15.65,54.99) v2(15.65,53.82) v2(15.65,52.59) v2(15.74,12.54) v2(16.27,88.52) v2(16.26,61.16) v2(16.42,86.97) v2(16.42,59.78) v2(16.49,85.59) v2(16.6,48.36) v2(16.6,46.88) v2(16.7,51.21) v2(16.7,49.74) v2(16.65,44.74) v2(16.69,12.54) v2(16.81,54.99) v2(16.81,53.82) v2(16.81,52.59) v2(16.83,9.73) v2(17.14,13.25) v2(17.43,88.52) v2(17.42,61.16) v2(17.57,86.97) v2(17.57,59.78) v2(17.59,10.59) v2(17.64,85.59) v2(17.75,48.36) v2(17.75,46.88) v2(17.8,44.74) v2(17.78,9.73) v2(17.86,51.21) v2(17.86,49.74) v2(17.96,54.99) v2(17.96,53.82) v2(17.96,52.59) v2(18.09,13.25) v2(18.25,11.82) v2(18.58,88.52) v2(18.57,61.16) v2(18.54,10.59) v2(18.73,86.97) v2(18.72,59.78) v2(18.73,9.73) v2(18.79,85.59) v2(18.77,1.16) v2(18.91,48.36) v2(18.91,46.88) v2(19.01,51.21) v2(19.01,49.74) v2(18.96,44.74) v2(19.11,54.99) v2(19.11,53.82) v2(19.11,52.59) v2(19.04,13.25) v2(19.21,11.82) v2(19.49,10.59) v2(19.73,88.52) v2(19.72,1.16) v2(19.88,86.97) v2(19.87,59.78) v2(19.94,85.59) v2(20.06,48.36) v2(20.06,46.88) v2(20.11,44.74) v2(20.16,51.21) v2(20.16,49.74) v2(20.16,11.82) v2(20.26,54.99) v2(20.26,53.82) v2(20.26,52.59) v2(20.25,4.63) v2(20.45,10.59) v2(20.67,1.16) v2(20.88,88.52) v2(21.03,86.97) v2(21.03,59.78) v2(21.11,11.82) v2(21.21,48.36) v2(21.21,46.88) v2(21.2,4.63) v2(21.31,51.21) v2(21.31,49.74) v2(21.26,44.74) v2(21.41,54.99) v2(21.41,53.82) v2(21.41,52.59) v2(21.44,3.74) v2(21.44,2.79) v2(21.44,1.83) v2(22.03,88.52) v2(22.18,59.78) v2(22.15,4.63) v2(22.37,84.9) v2(22.37,83.75) v2(22.37,82.6) v2(22.37,81.44) v2(22.37,80.29) v2(22.37,79.14) v2(22.37,77.99) v2(22.37,76.83) v2(22.36,48.36) v2(22.36,46.88) v2(22.41,44.74) v2(22.47,75.62) v2(22.47,74.47) v2(22.47,73.31) v2(22.47,72.16) v2(22.47,71.01) v2(22.47,69.86) v2(22.47,68.7) v2(22.47,67.55) v2(22.46,51.21) v2(22.46,49.74) v2(22.44,0.96) v2(22.57,54.99) v2(22.57,53.82) v2(22.57,52.59) v2(23.33,59.78) v2(23.39,0.96) v2(23.51,48.36) v2(23.51,46.88) v2(23.62,51.21) v2(23.62,49.74) v2(23.56,44.74) v2(23.66,96.43) v2(23.72,54.99) v2(23.72,53.82) v2(23.72,52.59) v2(24.12,12.28) v2(24.28,97.86) v2(24.34,0.96) v2(24.48,59.78) v2(24.62,96.43) v2(25.08,12.28) v2(25.23,97.86) v2(25.57,96.43) v2(25.55,3.52) v2(25.55,2.56) v2(25.55,1.61) v2(25.65,53.89) v2(25.65,52.72) v2(25.7,51.44) v2(25.65,50.12) v2(26.03,12.28) v2(26.18,97.86) v2(26.47,1.36) v2(26.6,53.89) v2(26.6,52.72) v2(26.6,50.12) v2(26.65,51.44) v2(26.77,24.11) v2(27.13,2.59) v2(27.24,27.33) v2(27.24,26.38) v2(27.24,25.43) v2(27.33,20.24) v2(27.43,31.2) v2(27.34,30.13) v2(27.34,29.18) v2(27.34,28.23) v2(27.42,1.36) v2(27.49,32.06) v2(27.49,21.91) v2(27.55,53.89) v2(27.55,52.72) v2(27.6,51.44) v2(27.55,50.12) v2(27.62,16.99) v2(27.61,16.12) v2(27.72,24.11) v2(27.64,17.78) v2(27.89,22.99) v2(27.95,21.15) v2(28.07,25.7) v2(28.08,2.59) v2(28.29,20.24) v2(28.44,32.06) v2(28.39,31.2) v2(28.44,21.91) v2(28.37,1.36) v2(28.59,17.78) v2(28.57,16.99) v2(28.56,16.12) v2(28.68,24.11) v2(28.87,52.8) v2(28.87,51.84) v2(28.87,50.18) v2(28.87,49.23) v2(28.87,48.27) v2(28.86,34.05) v2(28.84,22.99) v2(28.9,21.15) v2(29.02,25.7) v2(29.03,2.59) v2(29.24,20.24) v2(29.32,1.36) v2(29.39,32.06) v2(29.34,31.2) v2(29.39,21.91) v2(29.53,24.73) v2(29.53,16.99) v2(29.51,16.12) v2(29.54,17.78) v2(29.81,34.05) v2(29.8,22.99) v2(29.85,21.15) v2(29.97,25.7) v2(29.98,2.59) v2(30.48,24.73) v2(30.77,34.05) v2(31.44,24.73) v2(31.67,3.4) v2(32.33,4.63) v2(32.62,3.4) v2(33.28,4.63) v2(33.6,34.92) v2(33.57,3.4) v2(34.23,4.63) v2(34.27,36.14) v2(34.52,3.4) v2(34.56,34.92) v2(34.88,97.91) v2(35.22,36.14) v2(35.19,4.63) v2(35.51,34.92) v2(35.84,97.91) v2(35.9,67.82) v2(36.17,36.14) v2(36.14,16.7) v2(36.31,10.44) v2(36.46,34.92) v2(36.7,19.35) v2(36.79,97.91) v2(36.8,17.92) v2(36.86,67.82) v2(37.12,36.14) v2(37.09,16.7) v2(37.37,20.57) v2(37.53,54.81) v2(37.52,53.44) v2(37.58,51.9) v2(37.65,19.35) v2(37.79,68.84) v2(37.81,67.82) v2(37.76,17.92) v2(37.84,10.54) v2(37.99,96.81) v2(37.94,73.63) v2(38.05,16.7) v2(38.04,1.16) v2(38.15,86.56) v2(38.32,20.57) v2(38.48,54.81) v2(38.47,53.44) v2(38.53,51.9) v2(38.5,11.77) v2(38.54,84.09) v2(38.61,19.35) v2(38.6,3.81) v2(38.71,17.92) v2(38.71,2.38) v2(38.74,68.84) v2(38.79,10.54) v2(38.9,73.63) v2(38.99,1.16) v2(39.07,82.3) v2(39.12,76.85) v2(39.07,69.96) v2(39.09,60.55) v2(39.14,96.81) v2(39.31,86.56) v2(39.32,78.07) v2(39.27,20.57) v2(39.27,5.03) v2(39.42,80.11) v2(39.42,71.39) v2(39.44,54.81) v2(39.42,53.44) v2(39.35,13.19) v2(39.49,84.09) v2(39.49,51.9) v2(39.45,11.77) v2(39.58,85.21) v2(39.63,78.99) v2(39.56,19.35) v2(39.56,3.81) v2(39.69,68.84) v2(39.66,2.38) v2(39.74,10.54) v2(39.85,73.63) v2(40.02,82.3) v2(40.02,69.96) v2(40.01,14.42) v2(39.95,1.16) v2(40.07,76.85) v2(40.22,20.57) v2(40.22,5.03) v2(40.3,96.81) v2(40.27,78.07) v2(40.3,13.19) v2(40.38,80.11) v2(40.38,71.39) v2(40.41,11.77) v2(40.46,86.56) v2(40.53,85.21) v2(40.44,84.09) v2(40.51,3.81) v2(40.58,78.99) v2(40.61,2.38) v2(40.69,10.54) v2(40.9,1.16) v2(40.97,82.3) v2(41.02,76.85) v2(40.97,69.96) v2(41,40.53) v2(40.97,14.42) v2(41.22,78.07) v2(41.15,35.53) v2(41.17,5.03) v2(41.33,80.11) v2(41.33,71.39) v2(41.25,13.19) v2(41.36,11.77) v2(41.45,96.81) v2(41.48,85.21) v2(41.53,78.99) v2(41.46,3.81) v2(41.61,86.56) v2(41.56,43.18) v2(41.56,2.38) v2(41.66,41.75) v2(41.82,36.76) v2(41.92,14.42) v2(41.95,40.53) v2(42.1,35.53) v2(42.12,5.03) v2(42.21,59.58) v2(42.22,44.41) v2(42.52,63.61) v2(42.51,43.18) v2(42.47,15.88) v2(42.6,96.81) v2(42.62,41.75) v2(42.76,86.56) v2(42.77,36.76) v2(42.9,40.53) v2(43.06,35.53) v2(43.18,44.41) v2(43.14,7.94) v2(43.47,43.18) v2(43.49,17.21) v2(43.57,41.75) v2(43.72,36.76) v2(43.75,96.81) v2(43.91,86.56) v2(43.86,40.53) v2(44.01,35.53) v2(43.95,27.33) v2(44.13,44.41) v2(44.09,28.44) v2(44.2,26.05) v2(44.42,43.18) v2(44.52,41.75) v2(44.67,36.76) v2(44.72,5.19) v2(44.9,96.81) v2(44.9,27.33) v2(44.96,25.28) v2(45.07,86.56) v2(45.08,44.41) v2(45.05,28.44) v2(45.15,26.05) v2(45.28,7.84) v2(45.39,6.41) v2(45.68,5.19) v2(45.86,27.33) v2(45.91,25.28) v2(46,28.44) v2(45.95,9.06) v2(46.06,96.81) v2(46.1,26.05) v2(46.22,86.56) v2(46.24,7.84) v2(46.34,6.41) v2(46.63,5.19) v2(46.87,25.28) v2(46.9,9.06) v2(47.19,7.84) v2(47.29,6.41) v2(47.45,29.46) v2(47.58,5.19) v2(47.79,73.43) v2(47.85,9.06) v2(48.02,63.76) v2(48.17,28.34) v2(48.14,7.84) v2(48.29,96.81) v2(48.24,6.41) v2(48.4,29.46) v2(48.74,73.43) v2(48.8,9.06) v2(48.99,34.77) v2(49.13,28.34) v2(49.06,1) v2(49.32,39.25) v2(49.32,38.29) v2(49.32,37.34) v2(49.32,36.39) v2(49.37,45.11) v2(49.37,44.16) v2(49.37,43.21) v2(49.37,42.26) v2(49.36,29.46) v2(49.45,96.81) v2(49.62,3.66) v2(49.69,73.43) v2(49.72,2.23) v2(49.94,34.77) v2(50.01,1) v2(50.08,28.34) v2(50.28,4.88) v2(50.53,68.06) v2(50.6,96.81) v2(50.6,44.45) v2(50.6,43.5) v2(50.6,42.54) v2(50.6,41.59) v2(50.54,38.58) v2(50.54,37.63) v2(50.54,36.68) v2(50.54,35.73) v2(50.57,3.66) v2(50.67,2.23) v2(50.89,34.77) v2(50.96,1) v2(51.23,4.88) v2(51.48,68.06) v2(51.52,3.66) v2(51.62,2.23) v2(51.75,96.81) v2(51.91,1) v2(52.19,4.88) v2(52.44,68.06) v2(52.51,26.61) v2(52.46,25.38) v2(52.47,3.66) v2(52.58,2.23) v2(52.71,27.73) v2(52.9,96.81) v2(53.14,4.88) v2(53.41,25.38) v2(53.46,26.61) v2(53.66,27.73) v2(54.05,96.81) v2(54.16,84.31) v2(54.26,85.39) v2(54.32,37.21) v2(54.32,36.25) v2(54.32,35.3) v2(54.41,26.61) v2(54.36,25.38) v2(54.58,38.18) v2(54.62,27.73) v2(54.87,86.51) v2(55.21,96.81) v2(55.31,84.31) v2(55.24,39.41) v2(55.41,85.39) v2(55.53,38.18) v2(56.02,86.51) v2(56.1,93.9) v2(56.1,69.73) v2(56.2,39.41) v2(56.36,96.81) v2(56.46,84.31) v2(56.49,38.18) v2(56.56,85.39) v2(56.71,95.69) v2(56.89,80.91) v2(56.89,79.76) v2(56.89,78.61) v2(56.89,77.46) v2(56.89,76.3) v2(56.89,75.15) v2(56.89,74) v2(56.89,72.85) v2(57.18,86.51) v2(57.15,39.41) v2(57.26,93.9) v2(57.26,69.73) v2(57.44,38.18) v2(57.62,84.31) v2(57.72,85.39) v2(57.86,95.69) v2(58.1,39.41) v2(58.33,86.51) v2(58.41,93.9) v2(58.41,69.73) v2(58.77,84.31) v2(58.87,85.39) v2(59.01,95.69) v2(59.48,86.51) v2(59.56,93.9) v2(59.56,69.73) v2(59.92,84.31) v2(60.02,85.39) v2(60.16,95.69) v2(60.63,86.51) v2(60.71,93.9) v2(60.71,69.73) v2(61.07,84.31) v2(61.17,85.39) v2(61.32,95.69) v2(61.42,54.4) v2(61.79,86.51) v2(61.87,93.9) v2(61.87,69.73) v2(62.08,55.63) v2(62.22,84.31) v2(62.2,26.94) v2(62.33,85.39) v2(62.37,54.4) v2(62.47,95.69) v2(62.86,20.05) v2(63.02,93.9) v2(62.94,86.51) v2(63.02,69.73) v2(63.03,55.63) v2(63.32,54.4) v2(63.42,38.03) v2(63.62,95.69) v2(63.98,55.63) v2(64.17,93.9) v2(64.17,69.73) v2(64.27,54.4) v2(64.38,38.03) v2(64.77,95.69) v2(64.93,55.63) v2(65.33,38.03) v2(65.58,8.25) v2(66.14,10.9) v2(66.25,9.47) v2(66.5,98.85) v2(66.53,8.25) v2(66.81,12.12) v2(67.1,10.9) v2(67.15,32.39) v2(67.2,9.47) v2(67.49,8.25) v2(67.65,98.85) v2(67.76,21.84) v2(67.76,12.12) v2(67.84,60.73) v2(68.05,10.9) v2(68.15,9.47) v2(68.4,58.46) v2(68.4,57.51) v2(68.4,56.56) v2(68.4,55.61) v2(68.44,8.25) v2(68.55,64.19) v2(68.55,63.23) v2(68.55,62.28) v2(68.71,12.12) v2(68.81,98.85) v2(68.8,60.73) v2(69,10.9) v2(69.1,9.47) v2(69.24,72.25) v2(69.25,2.28) v2(69.44,32.5) v2(69.62,57.8) v2(69.62,56.85) v2(69.62,55.89) v2(69.62,54.94) v2(69.66,12.12) v2(69.77,63.52) v2(69.77,62.57) v2(69.77,61.62) v2(69.77,60.67) v2(69.82,4.93) v2(69.92,3.5) v2(69.96,98.85) v2(70.1,25.25) v2(70.19,72.25) v2(70.21,36.88) v2(70.21,2.28) v2(70.39,78.07) v2(70.48,6.16) v2(70.77,4.93) v2(70.87,3.5) v2(71.11,98.85) v2(71.14,72.25) v2(71.16,2.28) v2(71.43,6.16) v2(71.72,4.93) v2(71.82,3.5) v2(71.84,67.61) v2(72.11,2.28) v2(72.26,98.85) v2(72.35,60.78) v2(72.38,6.16) v2(72.62,8.14) v2(72.67,35.69) v2(72.67,4.93) v2(72.79,67.61) v2(72.77,3.5) v2(73.18,10.8) v2(73.32,60.79) v2(73.28,9.37) v2(73.33,6.16) v2(73.41,98.85) v2(73.49,80.15) v2(73.5,77.66) v2(73.57,8.14) v2(73.74,67.61) v2(73.84,12.02) v2(74,41.29) v2(74,40.33) v2(74,39.38) v2(74.03,38.06) v2(74.13,10.8) v2(74.24,9.37) v2(74.34,54.19) v2(74.52,32.57) v2(74.52,8.14) v2(74.57,98.85) v2(74.64,55.32) v2(74.8,12.02) v2(74.88,60.61) v2(74.86,59.54) v2(74.93,53.7) v2(75.09,10.8) v2(75.19,9.37) v2(75.48,8.14) v2(75.54,57.35) v2(75.66,23.62) v2(75.75,62.61) v2(75.75,12.02) v2(75.88,53.7) v2(76.04,10.8) v2(76.16,64.81) v2(76.14,9.37) v2(76.27,24.13) v2(76.36,66.29) v2(76.34,6.05) v2(76.58,69.04) v2(76.68,28.11) v2(76.7,12.02) v2(76.78,26.58) v2(76.9,8.71) v2(77.01,7.28) v2(77.31,66.29) v2(77.31,60) v2(77.33,58.01) v2(77.3,6.05) v2(77.35,61.07) v2(77.37,58.83) v2(77.57,9.93) v2(77.89,80.27) v2(77.86,8.71) v2(77.96,7.28) v2(78.25,6.05) v2(78.52,9.93) v2(78.81,8.71) v2(78.91,7.28) v2(78.94,60.27) v2(79.1,61.12) v2(79.13,22.4) v2(79.2,6.05) v2(79.47,9.93) v2(79.56,43.58) v2(79.56,42.63) v2(79.56,41.68) v2(79.76,8.71) v2(79.86,7.28) v2(79.95,30.1) v2(80.17,98.8) v2(80.42,9.93) v2(80.8,70.98) v2(80.92,61.12) v2(81.32,98.8) v2(81.61,76.28) v2(81.92,69.45) v2(82.07,77.25) v2(82.47,98.8) v2(82.65,26.27) v2(82.92,57.21) v2(82.96,60.47) v2(83.04,76.64) v2(83.13,59.55) v2(83.08,54.81) v2(83.48,52.16) v2(83.62,98.8) v2(83.59,58.43) v2(83.79,60.78) v2(83.74,56.03) v2(83.87,57.21) v2(84.03,54.81) v2(84.08,59.55) v2(84.15,53.38) v2(84.44,52.16) v2(84.54,58.43) v2(84.57,75.98) v2(84.69,56.03) v2(84.78,98.8) v2(84.74,60.78) v2(84.83,57.21) v2(85.03,59.55) v2(84.98,54.81) v2(85.1,53.38) v2(85.39,52.16) v2(85.49,58.43) v2(85.69,81.79) v2(85.69,60.78) v2(85.64,56.03) v2(85.8,82.61) v2(85.78,57.21) v2(85.76,50.68) v2(85.93,98.8) v2(85.9,83.47) v2(85.93,54.81) v2(85.98,59.55) v2(86.05,53.38) v2(86.34,52.16) v2(86.44,58.43) v2(86.59,56.03) v2(86.65,60.78) v2(86.71,50.68) v2(87,53.38) v2(87.08,98.8) v2(87.67,50.68) v2(88.01,59.15) v2(88.02,56.95) v2(88.23,98.8) v2(88.16,52.26) v2(88.25,8.32) v2(88.62,60.22) v2(88.69,58.18) v2(88.96,59.15) v2(88.97,56.95) v2(88.99,54.76) v2(89.11,52.26) v2(89.41,8.32) v2(89.57,60.22) v2(89.64,58.18) v2(89.65,55.98) v2(89.91,59.15) v2(89.93,56.95) v2(89.94,54.76) v2(90.06,52.26) v2(90.22,10.41) v2(90.27,21.63) v2(90.38,78.32) v2(90.52,60.22) v2(90.52,22.6) v2(90.59,58.18) v2(90.61,55.98) v2(90.56,9.24) v2(90.88,56.95) v2(90.9,54.76) v2(91.03,30.71) v2(91.12,88.78) v2(91.13,20.46) v2(91.42,21.63) v2(91.53,78.32) v2(91.52,29.9) v2(91.54,58.18) v2(91.56,55.98) v2(91.68,59.5) v2(91.67,22.6) v2(91.85,54.76) v2(92.18,30.71) v2(92.28,88.78) v2(92.29,20.46) v2(92.51,55.98) v2(92.63,59.5) v2(92.57,21.63) v2(92.68,78.32) v2(92.71,9.24) v2(92.83,22.6) v2(93.01,11.23) v2(93.17,48.49) v2(93.34,30.71) v2(93.29,10.16) v2(93.43,88.78) v2(93.44,20.46) v2(93.58,59.5) v2(93.72,21.63) v2(93.83,78.32) v2(93.84,49.71) v2(93.98,22.6) v2(94.13,48.49) v2(94.49,30.71) v2(94.58,88.78) v2(94.59,20.46) v2(94.75,51.09) v2(94.79,49.71) v2(94.88,21.63) v2(94.91,10.31) v2(94.99,78.32) v2(95.08,48.49) v2(95.13,22.6) v2(95.42,52.31) v2(95.73,88.78) v2(95.71,51.09) v2(95.64,30.71) v2(95.74,49.71) v2(95.74,20.46) v2(96.03,48.49) v2(96.03,21.63) v2(96.06,10.31) v2(96.14,78.32) v2(96.28,22.6) v2(96.37,52.31) v2(96.52,67.92) v2(96.66,51.09) v2(96.69,49.71) v2(96.79,30.71) v2(96.88,88.78) v2(96.9,20.46) v2(97.18,21.63) v2(97.21,10.31) v2(97.29,78.32) v2(97.32,52.31) v2(97.44,22.6) v2(97.47,67.92) v2(97.61,51.09) v2(97.64,64.91) v2(98.04,88.78) v2(97.94,30.71) v2(98.05,20.46) v2(98.27,52.31) v2(98.33,21.63) v2(98.43,67.92) v2(98.36,10.31) v2(98.44,78.32) v2(98.6,64.91) v2(98.59,22.6) v2(99.07,87.19) v2(99.07,86.04) v2(99.07,84.89) v2(99.07,83.74) v2(99.07,82.59) v2(99.07,81.43) v2(99.07,80.28) v2(99.07,79.13) v2(99.12,76.99) v2(99.12,75.84) v2(99.12,74.69) v2(99.12,73.54) v2(99.12,72.39) v2(99.12,71.23) v2(99.12,70.08) v2(99.12,68.93) v2(99.1,30.71) v2(99.19,88.78) v2(99.19,66.44) v2(99.2,20.46)
VIN_24V: length 12.9
  Top Layer w2: D3.2 33.01,16.55 34.5,18.04 34.5,25.82
(no net):
  vias: v1(30.45,29.84) v1(30.45,29.22) v1(30.45,28.6) v1(30.45,27.98) v1(30.45,27.36) v1(31.09,29.84) v1(31.09,29.22) v1(31.09,28.6) v1(31.09,27.98) v1(31.09,27.36) v1(31.73,29.84) v1(31.73,29.22) v1(31.73,28.6) v1(31.73,27.98) v1(31.73,27.36) v1(32.36,29.84) v1(32.36,29.22) v1(32.36,28.6) v1(32.36,27.98) v1(32.36,27.36)
A_DIR_O: length 84.7
  Top Layer w0.4: 66.9,62.82 50.45,62.82 44.91,57.28 13.65,57.28 11.5,55.14 11.5,46.17 5.38,40.05 5.38,34.86 3.21,32.68 2.96,32.68
A_STEP_O: length 86.4
  Top Layer w0.4: 66.9,62.17 50.87,62.17 45.32,56.62 14.05,56.62 12.12,54.68 12.12,45.86 6.2,39.94 6.2,33.13 3.21,30.14 2.96,30.14
C_DIR_O: length 12
  Top Layer w0.4: U8.2 63.22,59.02 61.33,60.9 57.44,60.9 H4.3
C_STEP_O: length 14.8
  Top Layer w0.4: U8.1 63.64,59.67 61.79,61.52 55.51,61.52 H4.2
D_DIR_O: length 12
  Top Layer w0.4: v2(62.15,57.39) 62.48,57.72 U8.4
  Bottom Layer w0.4: H5.3 57.49,55.8 60.57,55.8 v2(62.15,57.39)
D_STEP_O: length 14.9
  Top Layer w0.4: v2(61.28,58.1) 61.55,58.37 U8.3
  Bottom Layer w0.4: H5.2 55.56,56.42 59.6,56.42 v2(61.28,58.1)
ESP_BOOT: length 34.6
  Top Layer w0.4: v2(74.08,30.05) 77.29,30.05 K2.2 ; v2(75.66,32.65) 77.04,34.03 77.04,35.86 79.13,37.95 79.13,39.23 81.35,41.45 U9.25 ; Q4.3 65,29.59 v2(66.07,29.59)
  Bottom Layer w0.4: v2(75.66,32.65) 74.08,31.07 v2(74.08,30.05) 73.62,29.59 v2(66.07,29.59)
ESP_RST: length 60.7
  Top Layer w0.4: v2(90.35,50.55) 95.32,55.52 U9.3 ; v2(88.41,35.96) 86.99,34.54 84.69,34.54 83.06,32.9 83.06,28.11 v2(80.66,25.71) ; R37.2 70.75,27.73 Q5.3 71.94,27.19 72.5,26.63 72.5,25.47 R32.1 74.66,25.39 C26.2 74.74,25.46 v2(76.17,25.46)
  Bottom Layer w0.4: v2(88.41,35.96) 91.42,38.97 91.42,46.52 90.35,47.59 v2(90.35,50.55) ; v2(80.66,25.71) 80.41,25.46 v2(76.17,25.46)
I2S_BCK: length 24.9
  Top Layer w0.4: U9.12 83.89,64.67 83.36,65.2 80.1,65.2 78.37,63.47 76.41,63.47 ; 72.56,56.42 75.51,56.42 75.53,56.41 R17.1 76.47,63.41 76.41,63.47 ; 76.41,63.47 72.63,63.47
I2S_DATA: length 17
  Top Layer w0.4: U9.10 86.43,65.03 84.94,66.52 79.48,66.52 78.38,65.42 72.63,65.42
I2S_MR#: length 16.1
  Top Layer w0.4: 72.63,62.82 v2(71.23,62.82) ; R28.1 72.5,51.89 C21.2 72.54,53.31 71.23,54.63 v2(71.23,55.75) 71.24,55.77 72.56,55.77
  Bottom Layer w0.4: v2(71.23,62.82) v2(71.23,55.75)
I2S_WS: length 25.5
  Top Layer w0.4: v2(74.49,62.64) 75.61,61.52 75.61,58.56 74.12,57.07 72.56,57.07 ; 72.63,64.12 78.15,64.12 79.84,65.81 84.38,65.81 85.16,65.03 U9.11
  Bottom Layer w0.4: v2(74.03,64.12) 74.03,63.1 v2(74.49,62.64)
IO2: length 11.8
  Top Layer w0.4: v2(70.41,49.33) 70.3,49.44 R27.2 ; U9.24 v2(77.09,48.71)
  Bottom Layer w0.4: v2(77.09,48.71) 71.03,48.71 v2(70.41,49.33)
IO4: length 30.9
  Top Layer w0.4: v2(86.32,20.77) 89.19,17.9 R20.1 ; U9.26 v2(82.62,42.95)
  Bottom Layer w0.4: v2(82.62,42.95) 82.62,36.81 85.25,34.18 85.25,21.84 v2(86.32,20.77)
IO4_IN: length 11.5
  Top Layer w0.4: R18.2 89.36,16.27 R20.2 91.22,16.3 C18.2 91.25,16.31 93.66,13.9 P8.1
IO4_OUT: length 2.8
  Top Layer w0.4: H8.1 75.32,35.65 U13.4
IO12: length 15.5
  Top Layer w0.4: U9.14 79.21,62.92 78.98,62.69 v2(77.14,62.69) ; v2(74.74,71.05) R23.1
  Bottom Layer w0.4: v2(77.14,62.69) 74.74,65.09 v2(74.74,71.05)
IO12_IN: length 7.1
  Top Layer w0.4: C19.2 71.21,75.04 H1.2 ; C19.2 72.95,74.95 R19.2 ; C19.2 72.86,73.18 R23.2
IO14: length 25
  Top Layer w0.4: U13.2 76.27,42.69 v2(77.14,43.56) ; U9.13 82.62,61.52 82.04,60.94 v2(82.04,48.1)
  Bottom Layer w0.4: v2(77.14,43.56) 81.68,48.1 v2(82.04,48.1)
IO15: length 6.3
  Top Layer w0.4: U9.23 77.1,49.98 74.98,47.86 R39.1
IO15_IN: length 10.8
  Top Layer w0.4: v2(69.7,45.35) 69.95,45.61 C32.2 73.27,45.61 R38.2 73.38,45.71 R39.2
  Bottom Layer w0.4: H7.2 69.7,43.67 v2(69.7,45.35)
IO32: length 34
  Top Layer w0.4: R34.1 65.9,73.98 69.08,70.8 73.27,70.8 76.33,67.74 86.07,67.74 88.97,64.84 U9.8
IO32_IN: length 7
  Top Layer w0.4: H3.2 61.16,81.5 C24.2 64.79,80.94 64.95,80.78 65.9,80.78
IO33: length 28.4
  Top Layer w0.4: R33.1 66.16,72.65 68.62,70.19 72.5,70.19 75.56,67.13 85.35,67.13 87.7,64.78 U9.9
IO33_IN: length 8
  Top Layer w0.4: 62.55,75.89 62.38,75.72 C23.2 64.23,74.05 R33.2 ; 62.55,75.89 R30.2 ; 62.55,75.89 H2.2
M_EN: length 61.8
  Top Layer w0.4: 42.32,60.7 42.26,60.76 42.26,62.27 R14.1 ; 42.32,60.7 43.67,60.7 R16.1 45.69,61.12 v2(46.95,62.38) ; 42.32,60.7 U5.2 ; 72.63,66.07 v2(71.28,66.07) ; H5.1 46.29,54.49 43.33,51.52 R21.1 43.25,48.21 U7.2
  Bottom Layer w0.4: v2(71.28,66.07) 67.88,66.07 58.78,56.98 53.58,56.98 52.34,55.74 52.34,55.74 H5.1 H4.1 49.69,59.64 v2(46.95,62.38)
M_EN_A: length 54.3
  Top Layer w0.4: R26.2 41.51,51.57 39.1,49.16 U7.4 36.79,49.16 35.32,47.7 35.32,38.77 v2(31.75,35.2)
  Bottom Layer w0.4: v2(31.75,35.2) 10.3,35.2 2.7,27.6 P16.4
M_EN_O: length 83.1
  Top Layer w0.4: R14.2 39.42,63.32 U5.4 36.44,61.65 35.78,62.31 8.87,62.31 v2(7.12,64.07)
  Bottom Layer w0.4: 2.7,65.97 4.57,64.1 4.57,53.16 ; 2.7,65.97 P12.4 ; 2.7,65.97 5.22,65.97 ; 5.22,65.97 5.22,74.84 2.45,77.61 P15.4 ; 5.22,65.97 v2(7.12,64.07) ; 4.57,53.16 4.57,42.26 2.7,40.39 P10.4 ; 4.57,53.16 4.55,53.18 P11.4
PROBE: length 20.7
  Top Layer w0.4: U9.7 90.24,65.2 v2(89.79,65.65) ; v2(86.42,76.51) 86.42,77.69 86.41,77.71 86.41,79.63 85.84,80.21 U10.4
  Bottom Layer w0.4: v2(89.79,65.65) 86.42,69.01 v2(86.42,76.51)
PROBE_O: length 6.8
  Top Layer w0.4: P13.2 93.89,83.52 93.12,82.75 U10.2
PWM: length 35.9
  Top Layer w0.4: U9.16 78.16,58.87 ; 78.16,58.87 78.16,52.54 75.36,49.74 72.45,49.74 70.26,47.54 67.96,47.54 67.25,46.83 U11.2 ; 78.16,58.87 v2(78.16,61.92) ; U14.2 78.95,69.68 R46.1 78.94,69.44 v2(78.21,68.71)
  Bottom Layer w0.4: v2(78.21,68.71) 78.16,68.66 v2(78.16,61.92)
PWM_5V: length 5.4
  Top Layer w0.4: R48.2 79.9,76.33 79.9,74.52 81.9,74.52 R47.1
PWM_LAS: length 66.4
  Top Layer w0.4: U11.4 66.3,42.82 v2(65.28,41.8)
  Bottom Layer w0.4: v2(65.28,41.8) 34.86,11.38 25.28,11.38 16.88,2.99 P14.2
PWM_OUT: length 9.4
  Top Layer w0.6: P17.2 91.74,73.07 91.52,72.85 R42.1 88.83,74.39 Q3.3
PWM_OUT2: length 2
  Top Layer w0.4: v3(76.46,77.66) 76.97,77.66 78.05,76.58
R1IN: length 16.2
  Top Layer w0.4: v2(47.92,77.12) 47.89,77.09 U12.13
  Bottom Layer w0.4: DB1.3 52.48,80.2 49.91,77.63 48.43,77.63 v2(47.92,77.12)
RX2: length 5.6
  Top Layer w0.4: H9.2 97.59,34.89 92.27,34.89
RXD: length 96.8
  Top Layer w0.4: v2(62.2,31.02) 62.86,31.68 79.28,31.68 80.86,33.26 80.86,37.95 83.98,41.07 90.35,41.07 92.78,43.49 U9.34 ; v2(49.09,50.55) 48.12,51.52 v2(48.12,53) ; R40.1 44.91,67.61 v2(44.89,67.59) ; v2(53.07,30.71) 55,28.78 H6.2 56.89,28.63 R49.2
  Bottom Layer w0.4: v2(62.2,31.02) 58.98,31.02 H6.2 ; v2(53.07,30.71) 53.07,46.57 v2(49.09,50.55) ; v2(48.12,53) 44.65,56.47 44.65,67.35 v2(44.89,67.59)
RXD2: length 77.2
  Top Layer w0.4: R56.1 89.33,36.24 v2(89.33,39.08) ; v2(83.93,44.23) 83.93,45.89 U9.27 ; v2(46.18,67.53) 47.03,68.38 R45.1
  Bottom Layer w0.4: v2(89.33,39.08) 89.99,39.74 89.99,42.65 88.41,44.23 v2(83.93,44.23) 83.93,49.33 81.02,52.23 49.96,52.23 45.32,56.88 45.32,66.67 v2(46.18,67.53)
SD_CD: length 54.9
  Top Layer w0.4: R58.1 65.87,18.63 v2(65.87,17.4) 65.16,16.69 U16.9 ; U9.33 91.51,43.4 89.94,41.83 v2(89.18,41.83)
  Bottom Layer w0.4: v2(65.87,17.4) 84.49,17.4 87.6,20.51 87.6,40.25 v2(89.18,41.83)
SD_CS: length 37.8
  Top Layer w0.4: v2(74.39,18.83) 74.23,18.67 R52.1 73.33,17.79 72.86,17.32 U16.2 ; v2(75.15,22.45) 75.71,22.45 82.45,29.18 82.45,37.6 v2(84.54,39.69) ; U9.29 86.43,43.21 v2(85.97,42.75)
  Bottom Layer w0.4: v2(85.97,42.75) 84.54,41.32 v2(84.54,39.69) ; v2(75.15,22.45) 74.39,21.69 v2(74.39,18.83)
SD_MISO: length 43.4
  Top Layer w0.4: v2(68.83,18.68) 67.83,18.68 R55.1 67.82,17.79 67.36,17.33 U16.7 ; v2(79.03,32.65) 80.3,33.92 80.3,38.41 83.62,41.73 88,41.73 88.97,42.69 U9.31
  Bottom Layer w0.4: v2(68.83,18.68) 68.83,22.45 v2(79.03,32.65)
SD_MOSI: length 51.5
  Top Layer w0.4: U16.3 71.76,16.61 v2(71.74,16.64) 71.31,17.06 R53.1 ; v2(96.32,42.7) 96.59,42.97 U9.37
  Bottom Layer w0.4: v2(96.32,42.7) 88.77,35.15 88.77,20.51 84.89,16.64 v2(71.74,16.64)
SD_SCLK: length 40.6
  Top Layer w0.4: v2(71.17,25.76) 71.17,21.84 69.56,20.23 U16.5 ; U9.30 87.7,43.72 v2(87.39,43.41) ; v2(84.03,42.8) 83.91,42.8 79.74,38.63 79.74,34.28 v2(78.03,32.57)
  Bottom Layer w0.4: v2(87.39,43.41) 84.64,43.41 v2(84.03,42.8) ; v2(78.03,32.57) 71.23,25.76 v2(71.17,25.76)
SW2: length 24.6
  Top Layer w0.4: U9.36 95.32,39.4 v2(94.63,38.72) ; U4.2 86.61,26.74 R15.1 89.43,28.62 v2(89.99,29.18)
  Bottom Layer w0.4: v2(94.63,38.72) 89.99,34.08 v2(89.99,29.18)
SW2_OUT: length 13.6
  Top Layer w0.4: 97.62,26.75 94.45,26.75 92.95,25.25 86.42,25.25 85.58,24.41 U4.4
T1OUT: length 13.6
  Top Layer w0.4: U12.14 v2(49.16,78.35)
  Bottom Layer w0.4: DB1.2 49.16,88.08 v2(49.16,78.35)
TX2: length 5.6
  Top Layer w0.4: H9.3 97.68,37.8 R54.2
TXD: length 98.8
  Top Layer w0.4: v2(52.25,31.43) 56.64,31.43 H6.1 58.76,28.26 R50.2 ; R41.1 42.8,67.81 v2(42.97,67.64) ; v2(47.92,49.63) 46.59,50.96 v2(46.59,53.05) ; U9.35 94.05,43.69 90.76,40.4 84.18,40.4 81.63,37.85 81.63,33.16 79.54,31.07 63.93,31.07 v2(63.01,30.15)
  Bottom Layer w0.4: v2(46.59,53.05) 43.48,56.16 43.48,67.13 v2(42.97,67.64) ; v2(63.01,30.15) 60.65,30.15 H6.1 ; v2(52.25,31.43) 52.25,45.3 v2(47.92,49.63)
TXD2: length 73.7
  Top Layer w0.4: U9.28 85.16,47.04 v2(86.12,48) ; R43.1 49.14,69.22 v2(47.66,67.74) ; v2(90.55,39.18) 90.55,37.95 R54.1
  Bottom Layer w0.4: v2(90.55,39.18) 90.55,46.33 88.87,48 v2(86.12,48) 81.32,52.8 50.52,52.8 45.98,57.33 45.98,66.06 v2(47.66,67.74)
USB_DM: length 6.6
  Top Layer w0.3: U17.3 46.1,15.59 44.2,13.69 44.2,12.71
USB_DP: length 10.9
  Top Layer w0.3: U17.1 47.14,17.49 43.02,13.37 43.02,11.89 44.2,10.71
VUSB: length 16.2
  Top Layer w0.5: P18.1 49.25,12.71 50.32,13.78 50.32,16.02 50.83,16.54 U17.5 ; v2(44.91,18.78) 44.9,18.79 D11.2
  Bottom Layer w0.5: v2(44.91,18.78) 46.7,16.99 P18.1
X_DIR_O: length 75.7
  Top Layer w0.4: 66.9,66.72 37.72,66.72 37.06,66.06 17.37,66.06 9.92,73.5 9.92,80.59 6.68,83.84 2.96,83.84
X_LIMT: length 33.2
  Top Layer w0.4: U9.6 91.51,65.87 v2(90.2,67.18) ; v2(74.9,79.88) 74.9,81.78 73.61,83.08 R5.2
  Bottom Layer w0.4: v2(90.2,67.18) 90.2,74.11 85.2,79.11 75.66,79.11 v2(74.9,79.88)
X_LIMT_I: length 11.3
  Top Layer w0.4: C5.2 72.03,84.18 72.02,84.19 R4.1 72.02,89.95 72.99,90.92 P3.1
X_STEP_O: length 74
  Top Layer w0.4: 66.9,66.07 37.99,66.07 37.26,65.34 16.96,65.34 8.55,73.76 8.55,79.16 6.41,81.3 2.96,81.3
Y_DIR_O: length 81.7
  Top Layer w0.4: 3.11,58.49 2.24,58.49 0.95,59.78 0.95,69.22 2.81,71.09 5.3,71.09 11.61,64.78 37.67,64.78 38.31,65.42 66.9,65.42
Y_LIMT: length 29.8
  Top Layer w0.4: 77.84,83.1 79.08,81.86 v2(79.08,80.13) ; U9.5 92.78,66.18 v2(91.32,67.64)
  Bottom Layer w0.4: v2(91.32,67.64) 90.75,68.21 90.75,74.34 84.96,80.13 v2(79.08,80.13)
Y_LIMT_I: length 12.4
  Top Layer w0.4: C8.2 76.31,84.13 76.25,84.19 R7.1 76.25,88.98 79.34,92.07 P4.1
Y_STEP_O: length 80.3
  Top Layer w0.4: 3.06,68.55 5.7,68.55 10.23,64.02 37.72,64.02 38.47,64.77 66.9,64.77
  Bottom Layer w0.4: P12.3 0.9,66.96 0.9,57.02 2.2,55.72 P11.3
Z_DIR_O: length 76.8
  Top Layer w0.4: 66.9,64.12 49.86,64.12 44.4,58.66 12.63,58.66 10.23,56.26 10.23,47.54 8.17,45.48 2.96,45.48
Z_LIMT: length 25.7
  Top Layer w0.4: v2(92.24,67.99) 94.05,66.18 U9.4 ; v2(83.47,81.46) 82.07,82.85 R12.2
  Bottom Layer w0.4: v2(83.47,81.46) 84.41,81.46 91.53,74.34 91.53,68.7 v2(92.24,67.99)
Z_LIMT_I: length 13.4
  Top Layer w0.4: C15.2 80.49,84.15 80.53,84.19 R11.1 80.53,86.65 85.95,92.07 P5.1
Z_STEP_O: length 77.9
  Top Layer w0.4: 2.96,42.94 7.21,42.94 10.84,46.57 10.84,55.86 12.93,57.95 44.71,57.95 50.23,63.47 66.9,63.47
$9N72390: length 9
  Top Layer w1: D4.2 39.43,23.3 L2.2 37.71,26.19 36.04,27.86 U2.2
$9N72392: length 4
  Top Layer w0.4: U2.4 34.32,32.07 33.72,32.67 R10.1
$9N72730: length 1.9
  Top Layer w0.4: 23.77,4.27 23.84,4.34 23.84,6.15
$9N85928: length 7.9
  Top Layer w0.4: 53.9,21.89 53.9,16.06 54.53,15.43 U15.4
$9N85949: length 6.2
  Top Layer w0.3: U15.5 54.66,14.16 53.27,15.55 53.27,17.15 52.93,17.49 U17.6
$9N85958: length 5.5
  Top Layer w0.3: U17.4 52.59,15.59 53.58,14.6 53.58,13.69 54.37,12.89 U15.6
$9N85962: length 11.7
  Top Layer w0.4: U15.7 57.27,11.62 61.05,7.84 Y1.2 60.76,6.19 C37.1
$9N85965: length 7.4
  Top Layer w0.4: C38.1 55.45,3.36 Y1.1 55.72,6.75 U15.8
$9N86544: length 8.5
  Top Layer w0.3: U15.2 56.96,17.97 57.71,18.73 57.71,22.14 56.89,22.96 R49.1
$9N86546: length 10
  Top Layer w0.3: R50.1 58.76,18.3 57.16,16.7 U15.3
$9N86982: length 19.6
  Top Layer w0.4: v2(65.97,28.62) 65.52,28.17 Q4.2 ; v2(65,21.33) 64.69,21.01 64.69,17.8 62.32,15.43 U15.13 ; R57.1 66.09,23.53 v2(66.79,24.23)
  Bottom Layer w0.4: v2(65,21.33) 66.79,23.11 v2(66.79,24.23) 66.79,27.8 v2(65.97,28.62)
$9N86987: length 16.3
  Top Layer w0.4: R51.1 63.52,23.45 63.52,22.65 64.14,22.04 ; Q5.2 68.21,23.77 66.48,22.04 64.14,22.04 ; 64.14,22.04 63.93,21.84 63.93,18.32 62.31,16.7 U15.14
$9N89334: length 2
  Top Layer w0.4: Q4.1 63.62,25.15 63.6,25.13
$9N89338: length 4.4
  Top Layer w0.4: Q5.1 67.74,28.14 66.79,27.19 66.79,26.33 65.59,25.13
$9N98710: length 32.5
  Top Layer w0.4: R32.2 75.15,21.22 v2(75.15,21.17) ; 80.63,18.78 K1.3 ; 80.63,18.78 80.61,18.79 R29.2 79.71,18.78 80.63,18.78 ; 80.63,18.78 v2(80.66,18.78) ; K1.3 v2(82.44,14.39) ; K1.3 82.44,18.32 83.5,19.39 C22.2 ; P9.1 83.77,2.77 82.44,4.1 K1.4 v2(82.44,11.33)
  Bottom Layer w0.4: v2(80.66,18.78) 77.55,18.78 v2(75.15,21.17) ; v2(82.44,14.39) v2(82.44,11.33)
$9N100840: length 2.2
  Top Layer w0.4: R13.1 73.1,33.02 D9.1
$9N100955: length 2.2
  Top Layer w0.4: D7.1 47.38,22.93 R9.1
$9N120731: length 6.3
  Top Layer w0.4: 72.56,58.37 73.53,58.37 74.13,58.97 74.13,61.77 73.73,62.17 72.63,62.17
$9N121473: length 2
  Top Layer w0.4: R22.2 D10.1
$9N121474: length 27.5
  Top Layer w0.4: v2(27.62,82.83) 27.45,82.66 D10.2 ; v2(30.32,84.72) 33.16,87.56 C17.2
  Top Layer w2: Q1.2 34.3,94.67 32.07,96.89 P7.1
  Bottom Layer w0.4: v2(30.32,84.72) 29.51,84.72 v2(27.62,82.83)
$9N121477: length 8.3
  Top Layer w0.4: R25.2 32.58,69.74 DZ1.2 32,70.73 Q1.1 31.95,73.69 Q2.2
$9N121478: length 3.4
  Top Layer w0.4: R24.1 29.09,79.36 Q2.3
$9N121481: length 51.5
  Top Layer w0.4: Q2.1 28.13,69.73 v2(28.41,69.45) ; v2(59.39,51.62) 65.07,51.62 67.21,49.49 R27.1
  Bottom Layer w0.4: v2(28.41,69.45) 46.24,51.62 v2(59.39,51.62)
$9N139059: length 15.3
  Top Layer w1.4: L1.1 16.38,32.05 D1.2 17.99,38.31 U1.2
$9N139060: length 5.8
  Top Layer w0.6: U1.4 21.39,38.18 R3.2 21.84,37.72 R2.1
$9N139064: length 1.8
  Top Layer w0.4: D2.1 22.62,13.62 R1.1
$9N139555: length 5.3
  Top Layer w0.4: Q3.1 86,75.34 R47.2 84.2,73.54 R44.1
$9N144738: length 11.5
  Top Layer w0.4: R43.2 v2(48.12,71.1) ; v2(43.84,71.1) R41.2 42.8,71.44 45.35,73.99 U12.11
  Bottom Layer w0.4: v2(48.12,71.1) v2(43.84,71.1)
$9N144781: length 6.4
  Top Layer w0.4: R40.2 R45.2 47.03,72 46.62,72.41 U12.12
$9N144999: length 7.4
  Top Layer w0.4: R35.2 87.19,81.97 88.95,80.21 U10.1
$9N145132: length 3.9
  Top Layer w0.4: C31.1 43.84,83.65 45.35,82.14 U12.6
$9N145210: length 3.3
  Top Layer w0.4: U12.2 50.43,81.6 49.32,82.71 C27.2
